# Altium project PicoPrint.PrjPCB (part 1 of 2)
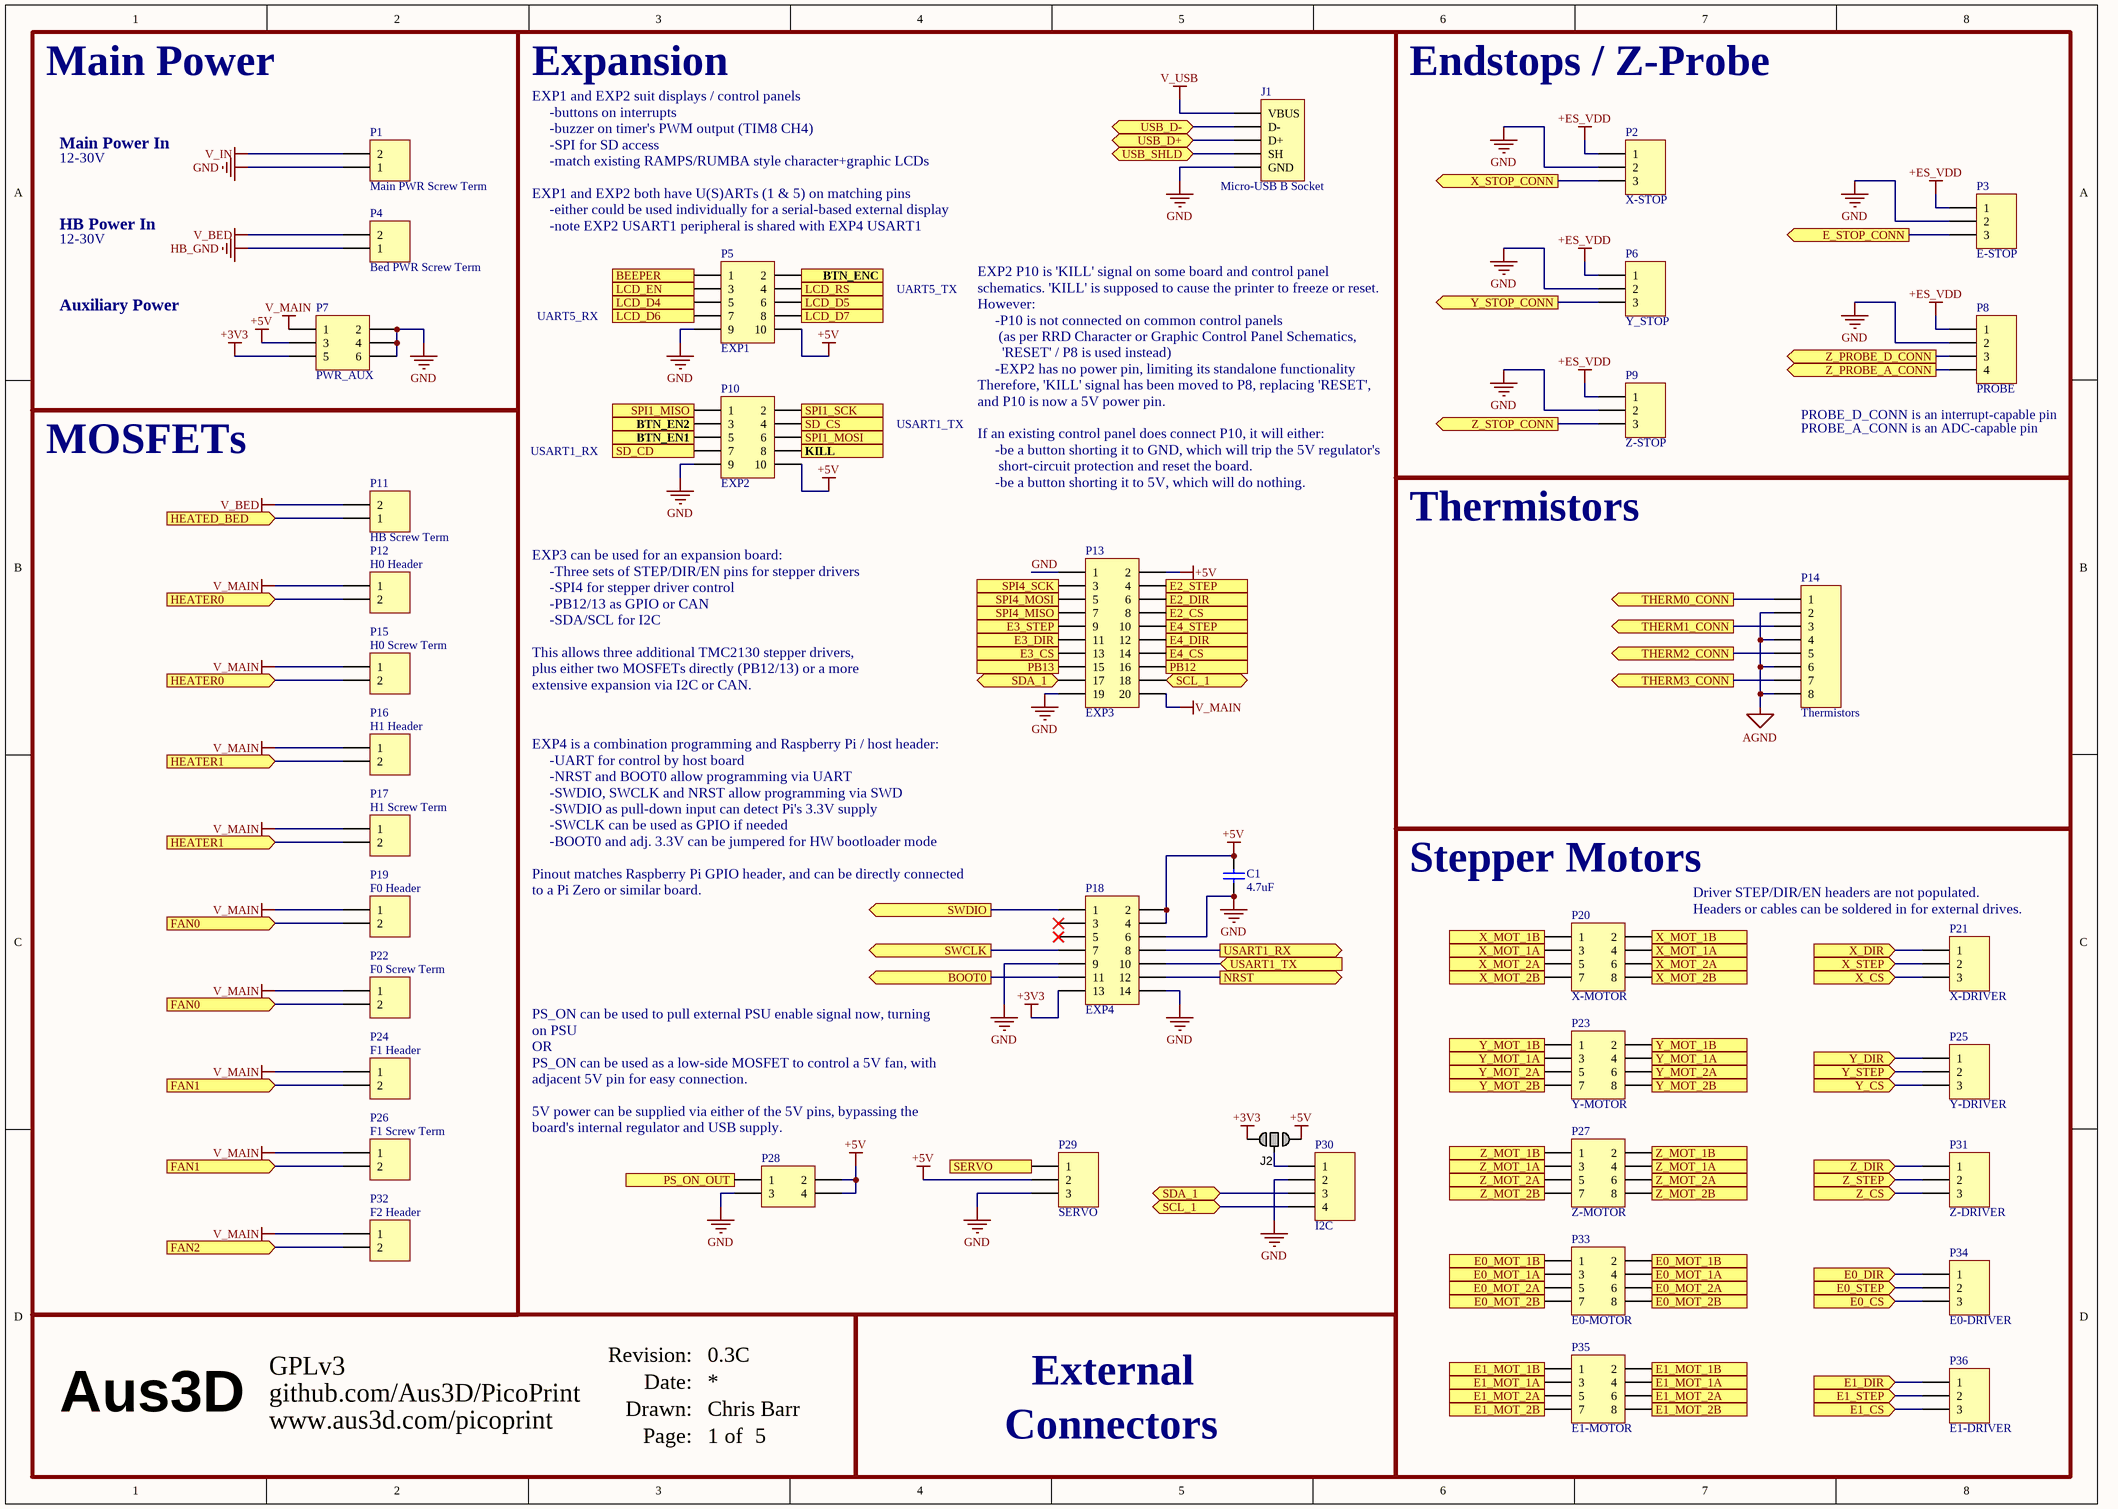
[diagram p0: PicoPrint-Connectors.SchDoc]
Project URL 2: www.aus3d.com/picoprint; Project URL 1: github.com/Aus3D/PicoPrint; Project Revision: 0.3C; Project License: GPLv3; Drawn By: Chris Barr
5 sheets, 296 parts. Net scope: flat (ports and power ports of the same name join across sheets).
Board file: PicoPrint.PcbDoc
Sheets:
  PicoPrint-Connectors.SchDoc
  PicoPrint-Power.SchDoc
  PicoPrint-MOSFETs.SchDoc
  PicoPrint-Motors.SchDoc
  PicoPrint-Main.SchDoc

## Sheet PicoPrint-Connectors.SchDoc
size A3; DocumentNumber: 1; SheetNumber: 1; SheetTotal: 5

### Parts
C1  value 4.7uF  [CAP 1005-0402]  (hidden comment: CapC-0402-4.7uF-10V)
J1  Micro-USB B Socket  [Micro-USB B Molex 105017-0001]
J2  Jumper  [JUMPER-3-NO]  (value not drawn)  (no BOM)
P1  Main PWR Screw Term  [TERM2 5MM]
P2  X-STOP  [HDR1X3-HEADER]
P3  E-STOP  [HDR1X3-HEADER]
P4  Bed PWR Screw Term  [TERM2 5MM]
P5  EXP1  [HDR2X5_exp Iner only\]
P6  Y_STOP  [HDR1X3-HEADER]
P7  PWR_AUX  [HDR2X3-Header]
P8  PROBE  [HDR1X4-HEADER]
P9  Z-STOP  [HDR1X3-HEADER]
P10  EXP2  [HDR2X5_exp Iner only\]
P11  HB Screw Term  [TERM2 5MM]
P12  H0 Header  [HDR1X2-HEADER]
P13  EXP3  [HDR2X10-HEADER]
P14  Thermistors  [HDR1X8-HEADER]
P15  H0 Screw Term  [TERM2 3.5mm]
P16  H1 Header  [HDR1X2-HEADER]
P17  H1 Screw Term  [TERM2 3.5mm]
P18  EXP4  [HDR2X7]
P19  F0 Header  [HDR1X2-HEADER]
P20  X-MOTOR  [HDR2X4-HEADER]
P21  X-DRIVER  [MHDR1X3]  (no BOM)
P22  F0 Screw Term  [TERM2 3.5mm]
P23  Y-MOTOR  [HDR2X4-HEADER]
P24  F1 Header  [HDR1X2-HEADER]
P25  Y-DRIVER  [MHDR1X3]  (no BOM)
P26  F1 Screw Term  [TERM2 3.5mm]
P27  Z-MOTOR  [HDR2X4-HEADER]
P28  Header 2X2  [HDR2X2-Header]  (value not drawn)
P29  SERVO  [HDR1X3-HEADER]
P30  I2C  [HDR1X4-HEADER]
P31  Z-DRIVER  [MHDR1X3]  (no BOM)
P32  F2 Header  [HDR1X2-HEADER]
P33  E0-MOTOR  [HDR2X4-HEADER]
P34  E0-DRIVER  [MHDR1X3]  (no BOM)
P35  E1-MOTOR  [HDR2X4-HEADER]
P36  E1-DRIVER  [MHDR1X3]  (no BOM)

### Blocks framed on the sheet
Main Power: P1 P4 P7
Endstops / Z-Probe: P2 P3 P6 P8 P9
MOSFETs: P11 P12 P15-P17 P19 P22 P24 P26 P32
Thermistors: P14
Stepper Motors: P20 P21 P23 P25 P27 P31 P33-P36

### Ports
BEEPER (in), BOOT0 (out), BTN_EN1 (out), BTN_EN2 (out), BTN_ENC (out), E0_CS (in), E0_DIR (in), E0_MOT_1A (in), E0_MOT_1B (in), E0_MOT_2A (in), E0_MOT_2B (in), E0_STEP (in), E1_CS (in), E1_DIR (in), E1_MOT_1A (in), E1_MOT_1B (in), E1_MOT_2A (in), E1_MOT_2B (in), E1_STEP (in), E2_CS (in), E2_DIR (in), E2_STEP (in), E3_CS (in), E3_DIR (in), E3_STEP (in), E4_CS (in), E4_DIR (in), E4_STEP (in), E_STOP_CONN (out), FAN0 (in), FAN1 (in), FAN2 (in), HEATED_BED (in), HEATER0 (in), HEATER1 (in), KILL (out), LCD_D4 (in), LCD_D5 (in), LCD_D6 (in), LCD_D7 (in), LCD_EN (in), LCD_RS (in), NRST (out), PB12 (in), PB13 (in), PS_ON_OUT (out), SCL_1 (bidir), SD_CD (out), SD_CS (in), SDA_1 (bidir), SERVO (in), SPI1_MISO (in), SPI1_MOSI (out), SPI1_SCK (out), SPI4_MISO (in), SPI4_MOSI (out), SPI4_SCK (out), SWCLK (out), SWDIO (out), THERM0_CONN (out), THERM1_CONN (out), THERM2_CONN (out), THERM3_CONN (out), USART1_RX (out), USART1_TX (in), USB_D+ (bidir), USB_D- (bidir), USB_SHLD (bidir), X_CS (in), X_DIR (in), X_MOT_1A (in), X_MOT_1B (in), X_MOT_2A (in), X_MOT_2B (in), X_STEP (in), X_STOP_CONN (out), Y_CS (in), Y_DIR (in), Y_MOT_1A (in), Y_MOT_1B (in), Y_MOT_2A (in), Y_MOT_2B (in), Y_STEP (in), Y_STOP_CONN (out), Z_CS (in), Z_DIR (in), Z_MOT_1A (in), Z_MOT_1B (in), Z_MOT_2A (in), Z_MOT_2B (in), Z_PROBE_A_CONN (out), Z_PROBE_D_CONN (out), Z_STEP (in), Z_STOP_CONN (out)

### Nets
+3V3: J2.1 P7.5 P18.13
+5V: C1.2 J2.3 P5.10 P7.3 P10.10 P13.2 P18.2 P18.4 P28.2 P28.4 P29.2
+ES_VDD: P2.1 P3.1 P6.1 P8.1 P9.1
AGND: P14.2 P14.4 P14.6 P14.8
GND: C1.1 J1.GND P1.1 P2.2 P3.2 P5.9 P6.2 P7.2 P7.4 P7.6 P8.2 P9.2 P10.9 P13.1 P13.19 P18.6 P18.9 P18.14 P28.3 P29.3 P30.2
HB_GND: P4.1
V_BED: P4.2 P11.2
V_IN: P1.2
V_MAIN: P7.1 P12.1 P13.20 P15.1 P16.1 P17.1 P19.1 P22.1 P24.1 P26.1 P32.1
V_USB: J1.VBUS
BEEPER: P5.1 ; port BEEPER
BOOT0: P18.11 ; port BOOT0
BTN_EN1: P10.5 ; port BTN_EN1
BTN_EN2: P10.3 ; port BTN_EN2
BTN_ENC: P5.2 ; port BTN_ENC
E0_CS: P34.3 ; port E0_CS
E0_DIR: P34.1 ; port E0_DIR
E0_MOT_1A: P33.3 P33.4 ; port E0_MOT_1A
E0_MOT_1B: P33.1 P33.2 ; port E0_MOT_1B
E0_MOT_2A: P33.5 P33.6 ; port E0_MOT_2A
E0_MOT_2B: P33.7 P33.8 ; port E0_MOT_2B
E0_STEP: P34.2 ; port E0_STEP
E1_CS: P36.3 ; port E1_CS
E1_DIR: P36.1 ; port E1_DIR
E1_MOT_1A: P35.3 P35.4 ; port E1_MOT_1A
E1_MOT_1B: P35.1 P35.2 ; port E1_MOT_1B
E1_MOT_2A: P35.5 P35.6 ; port E1_MOT_2A
E1_MOT_2B: P35.7 P35.8 ; port E1_MOT_2B
E1_STEP: P36.2 ; port E1_STEP
E2_CS: P13.8 ; port E2_CS
E2_DIR: P13.6 ; port E2_DIR
E2_STEP: P13.4 ; port E2_STEP
E3_CS: P13.13 ; port E3_CS
E3_DIR: P13.11 ; port E3_DIR
E3_STEP: P13.9 ; port E3_STEP
E4_CS: P13.14 ; port E4_CS
E4_DIR: P13.12 ; port E4_DIR
E4_STEP: P13.10 ; port E4_STEP
E_STOP_CONN: P3.3 ; port E_STOP_CONN
FAN0: P19.2 P22.2 ; port FAN0
FAN1: P24.2 P26.2 ; port FAN1
FAN2: P32.2 ; port FAN2
HEATED_BED: P11.1 ; port HEATED_BED
HEATER0: P12.2 P15.2 ; port HEATER0
HEATER1: P16.2 P17.2 ; port HEATER1
KILL: P10.8 ; port KILL
LCD_D4: P5.5 ; port LCD_D4
LCD_D5: P5.6 ; port LCD_D5
LCD_D6: P5.7 ; port LCD_D6
LCD_D7: P5.8 ; port LCD_D7
LCD_EN: P5.3 ; port LCD_EN
LCD_RS: P5.4 ; port LCD_RS
NRST: P18.12 ; port NRST
PB12: P13.16 ; port PB12
PB13: P13.15 ; port PB13
PS_ON_OUT: P28.1 ; port PS_ON_OUT
SCL_1: P13.18 P30.4 ; port SCL_1
SD_CD: P10.7 ; port SD_CD
SD_CS: P10.4 ; port SD_CS
SDA_1: P13.17 P30.3 ; port SDA_1
SERVO: P29.1 ; port SERVO
SPI1_MISO: P10.1 ; port SPI1_MISO
SPI1_MOSI: P10.6 ; port SPI1_MOSI
SPI1_SCK: P10.2 ; port SPI1_SCK
SPI4_MISO: P13.7 ; port SPI4_MISO
SPI4_MOSI: P13.5 ; port SPI4_MOSI
SPI4_SCK: P13.3 ; port SPI4_SCK
SWCLK: P18.7 ; port SWCLK
SWDIO: P18.1 ; port SWDIO
THERM0_CONN: P14.1 ; port THERM0_CONN
THERM1_CONN: P14.3 ; port THERM1_CONN
THERM2_CONN: P14.5 ; port THERM2_CONN
THERM3_CONN: P14.7 ; port THERM3_CONN
USART1_RX: P18.8 ; port USART1_RX
USART1_TX: P18.10 ; port USART1_TX
USB_N: J1.D- ; port USB_D-
USB_P: J1.D+ ; port USB_D+
USB_SHLD: J1.SHIELD(SH) ; port USB_SHLD
X_CS: P21.3 ; port X_CS
X_DIR: P21.1 ; port X_DIR
X_MOT_1A: P20.3 P20.4 ; port X_MOT_1A
X_MOT_1B: P20.1 P20.2 ; port X_MOT_1B
X_MOT_2A: P20.5 P20.6 ; port X_MOT_2A
X_MOT_2B: P20.7 P20.8 ; port X_MOT_2B
X_STEP: P21.2 ; port X_STEP
X_STOP_CONN: P2.3 ; port X_STOP_CONN
Y_CS: P25.3 ; port Y_CS
Y_DIR: P25.1 ; port Y_DIR
Y_MOT_1A: P23.3 P23.4 ; port Y_MOT_1A
Y_MOT_1B: P23.1 P23.2 ; port Y_MOT_1B
Y_MOT_2A: P23.5 P23.6 ; port Y_MOT_2A
Y_MOT_2B: P23.7 P23.8 ; port Y_MOT_2B
Y_STEP: P25.2 ; port Y_STEP
Y_STOP_CONN: P6.3 ; port Y_STOP_CONN
Z_CS: P31.3 ; port Z_CS
Z_DIR: P31.1 ; port Z_DIR
Z_MOT_1A: P27.3 P27.4 ; port Z_MOT_1A
Z_MOT_1B: P27.1 P27.2 ; port Z_MOT_1B
Z_MOT_2A: P27.5 P27.6 ; port Z_MOT_2A
Z_MOT_2B: P27.7 P27.8 ; port Z_MOT_2B
Z_PROBE_A_CONN: P8.4 ; port Z_PROBE_A_CONN
Z_PROBE_D_CONN: P8.3 ; port Z_PROBE_D_CONN
Z_STEP: P31.2 ; port Z_STEP
Z_STOP_CONN: P9.3 ; port Z_STOP_CONN
NetJ2_2: J2.2 P30.1

Not connected (* = marked no-connect by the designer): P18 3* 5*

### Notes on the sheet
- Expansion
- Main Power In
- 12-30V
- HB Power In
- (near P5) EXP1 and EXP2 suit displays / control panels
  -buttons on interrupts
  -buzzer on timer's PWM output (TIM8 CH4)
  -SPI for SD access
  -match existing RAMPS/RUMBA style character+graphic LCDs
  EXP1 and EXP2 both have U(S)ARTs (1 & 5) on matching pins
  -either could be used individually for a serial-based external display
  -note EXP2 USART1 peripheral is shared with EXP4 USART1
- Auxiliary Power
- UART5_RX
- UART5_TX
- USART1_RX
- USART1_TX
- (near P8) PROBE_D_CONN is an interrupt-capable pin
- (near P8) PROBE_A_CONN is an ADC-capable pin
- EXP2 P10 is 'KILL' signal on some board and control panel schematics. 'KILL' is supposed to cause the printer to freeze or reset. However:
  -P10 is not connected on common control panels
  (as per RRD Character or Graphic Control Panel Schematics,
  'RESET' / P8 is used instead)
  -EXP2 has no power pin, limiting its standalone functionality
  Therefore, 'KILL' signal has been moved to P8, replacing 'RESET', and P10 is now a 5V power pin.
  If an existing control panel does connect P10, it will either:
  -be a button shorting it to GND, which will trip the 5V regulator's
  short-circuit protection and reset the board.
  -be a button shorting it to 5V, which will do nothing.
- EXP3 can be used for an expansion board:
  -Three sets of STEP/DIR/EN pins for stepper drivers
  -SPI4 for stepper driver control
  -PB12/13 as GPIO or CAN
  -SDA/SCL for I2C
  This allows three additional TMC2130 stepper drivers,
  plus either two MOSFETs directly (PB12/13) or a more extensive expansion via I2C or CAN.
- EXP4 is a combination programming and Raspberry Pi / host header:
  -UART for control by host board
  -NRST and BOOT0 allow programming via UART
  -SWDIO, SWCLK and NRST allow programming via SWD
  -SWDIO as pull-down input can detect Pi's 3.3V supply
  -SWCLK can be used as GPIO if needed
  -BOOT0 and adj. 3.3V can be jumpered for HW bootloader mode
  Pinout matches Raspberry Pi GPIO header, and can be directly connected to a Pi Zero or similar board.
- (near P21) Driver STEP/DIR/EN headers are not populated.
  Headers or cables can be soldered in for external drives.
- (near P28) PS_ON can be used to pull external PSU enable signal now, turning on PSU
  OR
  PS_ON can be used as a low-side MOSFET to control a 5V fan, with adjacent 5V pin for easy connection.
  5V power can be supplied via either of the 5V pins, bypassing the board's internal regulator and USB supply.
- Date:
- Revision:
- External
- Aus3D
- Drawn:
- Page:
- of
- Connectors

### Library data of the parts
C1 = CapC-0402-4.7uF-10V: Capacitor (SMD Ceramic); Voltage: 10V; Note: Approved sub OK; Published: 8-Jun-2000; Revision: July-2002: Re-released for DXP Platform.; Publisher: Altium Limited; Supplier 1: Digi-Key; Supplier Part Number 1: 1276-1482-1-ND
J1 = Micro-USB B Socket: Note: Approved sub OK; Supplier 1: Digi-Key; Supplier Part Number 1: WM1399CT-ND
J2 = JUMP3-NO: SMD jumper
P1 P4 P11 = ScrewTerminal-5mm-2Way: Screw Terminal 5mm 2-Way; Supplier 1: Digi-Key; Supplier Part Number 1: 277-6405-ND
P2 P3 P6 P9 P29 = Header 3: Header, 3-Pin; Manufacturer 1: Generic Header; Note: Approved sub OK; LatestRevisionDate: 17-Jul-2002; LatestRevisionNote: Re-released for DXP Platform.; Publisher: Altium Limited
P5 P10 = Header 5X2: Header, 5-Pin, Dual row; Manufacturer 1: Generic Header; Note: Approved sub OK; LatestRevisionDate: 17-Jul-2002; LatestRevisionNote: Re-released for DXP Platform.; Publisher: Altium Limited
P7 = Header 3X2: Header, 3-Pin, Dual row; Manufacturer 1: Generic Header; Note: Approved sub OK; LatestRevisionDate: 17-Jul-2002; LatestRevisionNote: Re-released for DXP Platform.; Publisher: Altium Limited
P8 P30 = Header 4: Header, 4-Pin; Manufacturer 1: Generic Header; Note: Approved sub OK; LatestRevisionDate: 17-Jul-2002; LatestRevisionNote: Re-released for DXP Platform.; Publisher: Altium Limited
P12 P16 P19 P24 P32 = Header 2: Header, 2-Pin; Manufacturer 1: Generic Header; Note: Approved sub OK; LatestRevisionDate: 17-Jul-2002; LatestRevisionNote: Re-released for DXP Platform.; Publisher: Altium Limited
P13 = Header 10X2: Header, 10-Pin, Dual row; Manufacturer 1: Generic Header; Note: Approved sub OK; LatestRevisionDate: 17-Jul-2002; LatestRevisionNote: Re-released for DXP Platform.; Publisher: Altium Limited
P14 = Header 8x1: Header, 8-Pin; Manufacturer 1: Generic Header; Note: Approved sub OK; LatestRevisionDate: 17-Jul-2002; LatestRevisionNote: Re-released for DXP Platform.; Publisher: Altium Limited
P15 P17 P22 P26 = ScrewTerminal-3.5mm-2Way: Screw Terminal 3.5mm 2-Way; Supplier 1: Digi-Key; Supplier Part Number 1: 277-1721-ND
P18 = Header 7X2: Header, 7-Pin, Dual row; Manufacturer 1: Generic Header; Note: Approved sub OK; LatestRevisionDate: 17-Jul-2002; LatestRevisionNote: Re-released for DXP Platform.; Publisher: Altium Limited
P20 P23 P27 P33 P35 = Header 4X2: Header, 4-Pin, Dual row; Manufacturer 1: Generic Header; Note: Approved sub OK; LatestRevisionDate: 17-Jul-2002; LatestRevisionNote: Re-released for DXP Platform.; Publisher: Altium Limited
P21 P25 P31 P34 P36 = MHDR1X3: Header, 3-Pin; LatestRevisionDate: 17-Jul-2002; LatestRevisionNote: Re-released for DXP Platform.; Publisher: Altium Limited
P28 = Header 2X2: Header, 3-Pin, Dual row; Manufacturer 1: Generic Header; Note: Approved sub OK; LatestRevisionDate: 17-Jul-2002; LatestRevisionNote: Re-released for DXP Platform.; Publisher: Altium Limited

## Sheet PicoPrint-Power.SchDoc
size A3; DocumentNumber: 2; SheetNumber: 2; SheetTotal: 5
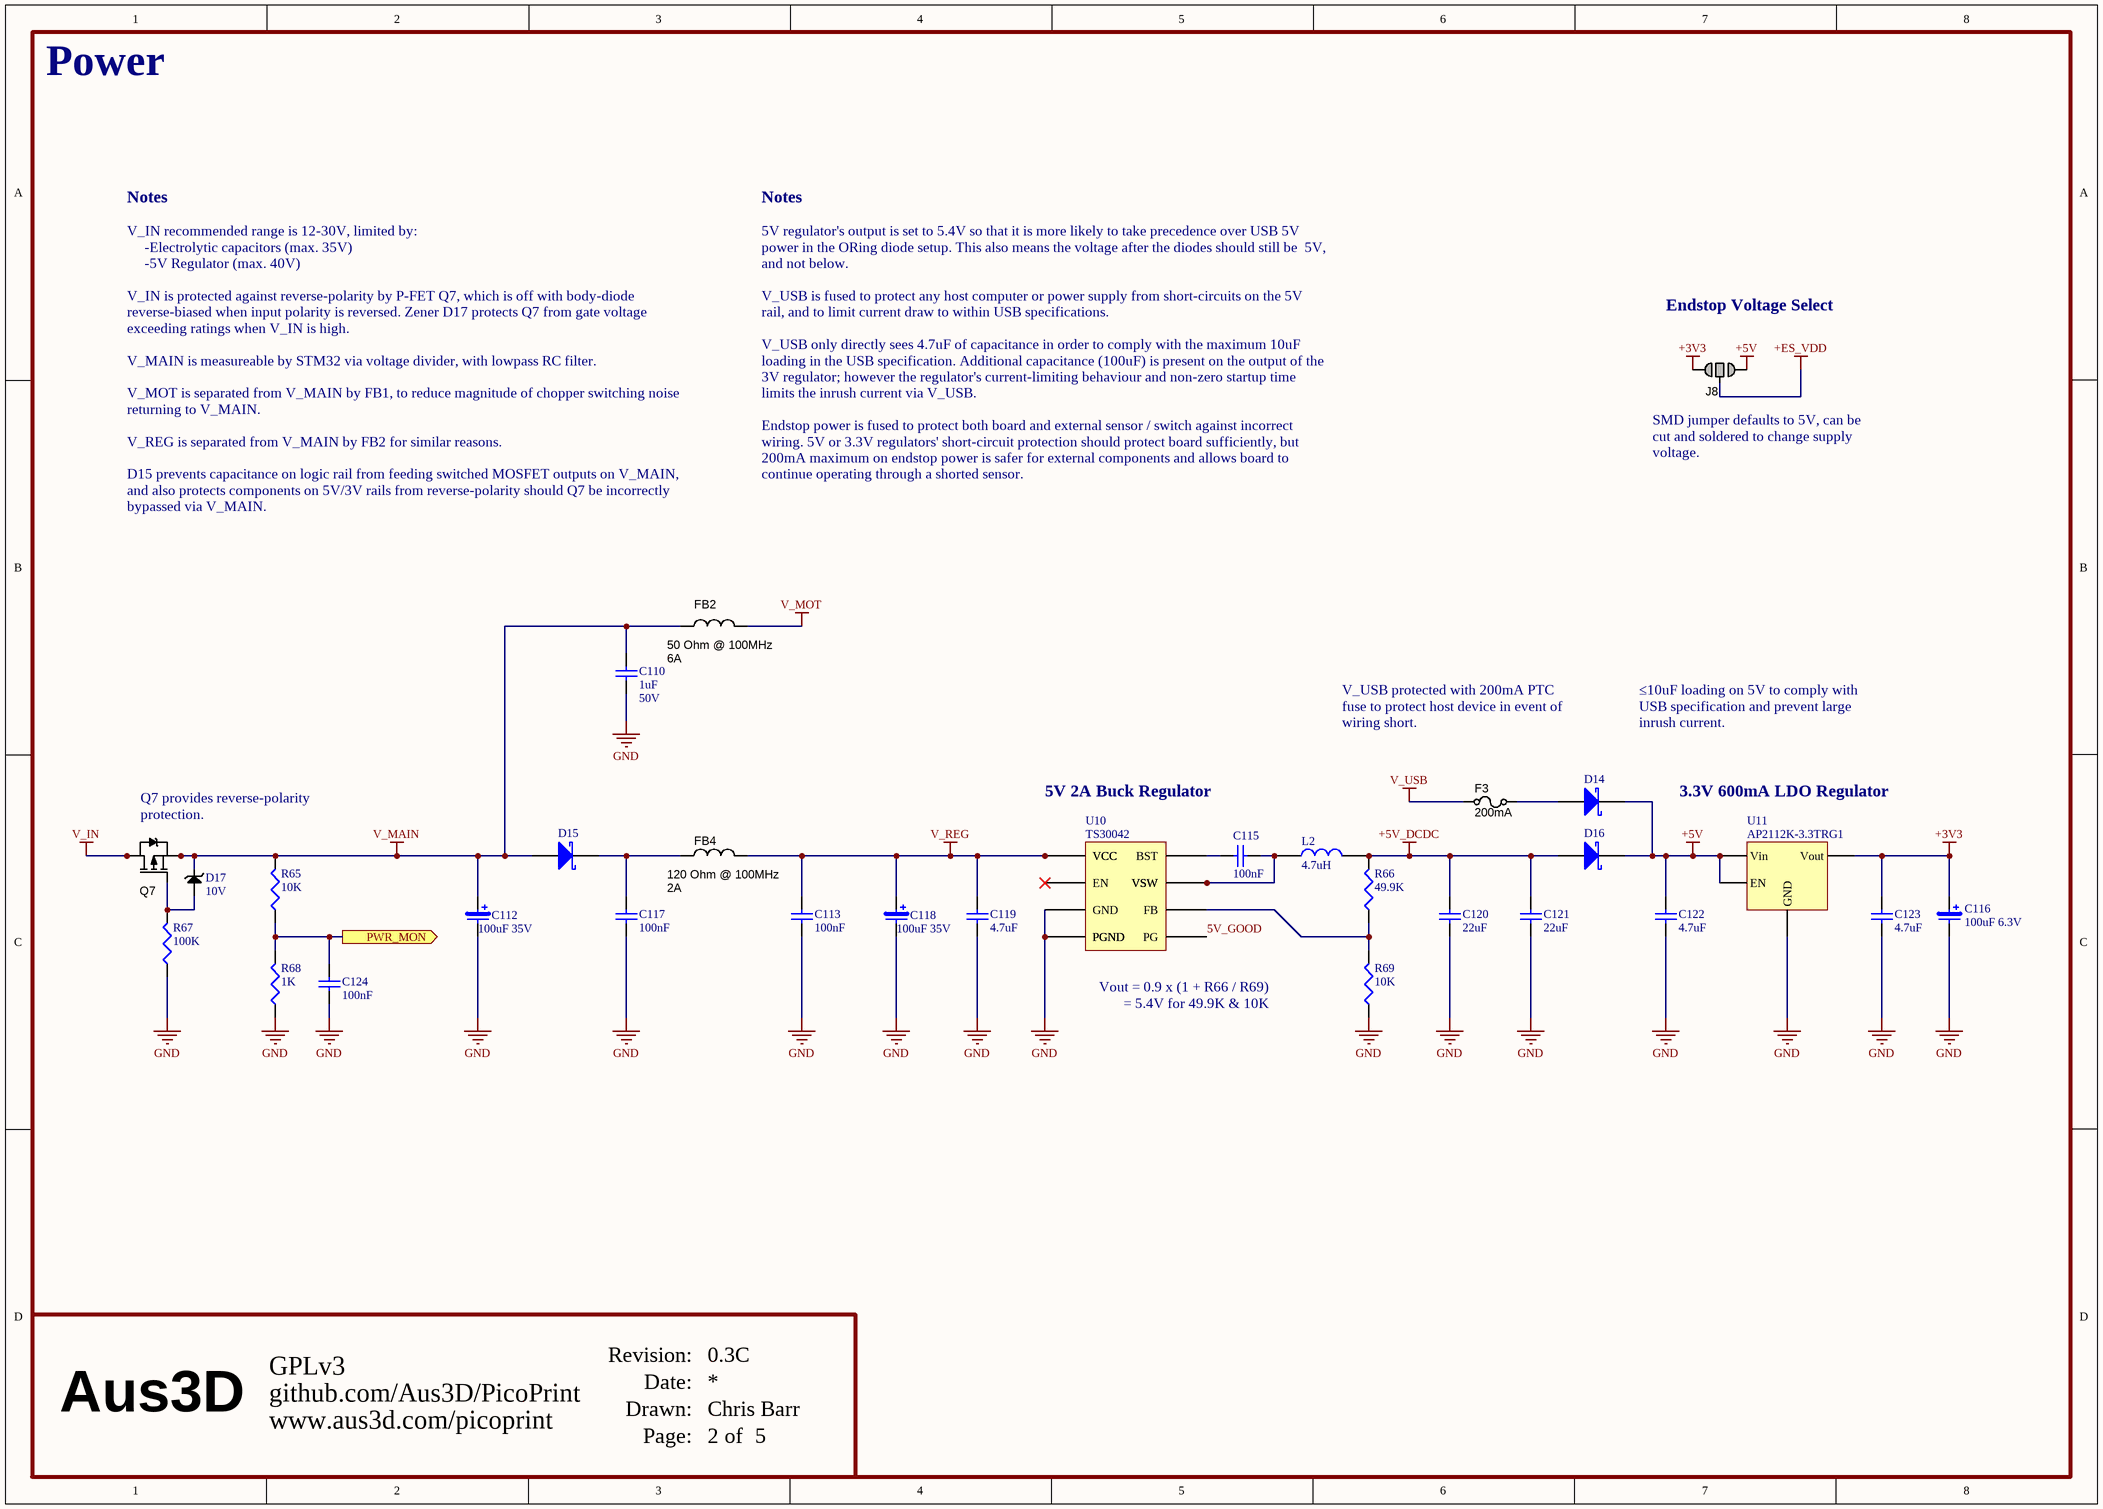
[diagram p1: PicoPrint-Power.SchDoc]

### Parts
C110  value 1uF  Voltage: 50V  [Cap 1608-0603]  (hidden comment: CapC-0603-1uF 50V)
C112  value 100uF 35V  [CAP EL PANASONIC]  (hidden comment: CapE-6.3-100uF-35V)
C113  value 100nF  [CAP 1005-0402]  (hidden comment: CapC-0402-100nF-50V)
C115  value 100nF  [CAP 1005-0402]  (hidden comment: CapC-0402-100nF)
C116  value 100uF 6.3V  [CAP EL 5mm]  (hidden comment: CapE-5.0-100uF-6.3V)
C117  value 100nF  [CAP 1005-0402]  (hidden comment: CapC-0402-100nF-50V)
C118  value 100uF 35V  [CAP EL PANASONIC]  (hidden comment: CapE-6.3-100uF-35V)
C119  value 4.7uF  [CAP 3225-1210]  (hidden comment: CapC-1210-4.7uF-50V)
C120  value 22uF  [CAPC2012X135N]  (hidden comment: CapC-0805-22uF 6.3V)
C121  value 22uF  [CAPC2012X135N]  (hidden comment: CapC-0805-22uF 6.3V)
C122  value 4.7uF  [CAP 1005-0402]  (hidden comment: CapC-0402-4.7uF-10V)
C123  value 4.7uF  [CAP 1005-0402]  (hidden comment: CapC-0402-4.7uF-10V)
C124  value 100nF  [CAP 1005-0402]  (hidden comment: CapC-0402-100nF)
D14  Schottky 2A 40V SOD-123F  [DIOM2616X08N]  (value not drawn)
D15  Schottky 2A 40V SOD-123F  [DIOM2616X08N]  (value not drawn)
D16  Schottky 2A 40V SOD-123F  [DIOM2616X08N]  (value not drawn)
D17  Voltage: 10V  [SOD523]  (hidden comment: Zener 10V 150mW SOD523)
F3  value 200mA  [RES 3216-1206]  (hidden comment: PTC Resettable Fuse)
FB2  Impedance @ Frequency: 50 Ohm @ 100MHz  Current Rating: 6A  [INDC3216X13N]  (hidden comment: 50R @ 100 MHz)
FB4  Impedance @ Frequency: 120 Ohm @ 100MHz  Current Rating: 2A  [INDC1608N]  (hidden comment: 120R @ 100 MHz)
J8  Jumper  [JUMPER-3-NO]  (value not drawn)  (no BOM)
L2  value 4.7uH  [INDUCTOR_NRS5030T4R7MMGJ]  (hidden comment: Inductor SMD 4.7uH 2.6A)
Q7  SI7111EDN-T1-GE3  [PowerPAK 1218-8 Single]  (value not drawn)
R65  value 10K  [RESC1005X40N]  (hidden comment: Res-0402-10K)
R66  value 49.9K  [RESC1005X40N]  (hidden comment: Res-0402-49.9K)
R67  value 100K  [RESC1005X40N]  (hidden comment: Res-0402-100K)
R68  value 1K  [RESC1005X40N]  (hidden comment: Res-0402-1K)
R69  value 10K  [RESC1005X40N]  (hidden comment: Res-0402-10K)
U10  TS30042  [QFN50P300X300X100_HS-17N]
U11  AP2112K-3.3TRG1  [SOT23-5]

### Ports
PWR_MON (out)

### Nets
+3V3: C116.1 C123.2 J8.1 U11.5(Vout)
+5V: C122.2 D14.K D16.K J8.3 U11.1(Vin) U11.3(EN)
+5V_DCDC: C120.2 C121.2 D16.A L2.2 R66.2
+ES_VDD: J8.2
GND: C110.1 C112.2 C113.1 C116.2 C117.1 C118.2 C119.1 C120.1 C121.1 C122.1 C123.1 C124.1 R67.1 R68.1 R69.1 U10.4(GND) U10.14(PGND) U10.15(PGND) U10.17(PGND) U11.2(GND)
V_IN: Q7.5(D) Q7.6(D) Q7.7(D) Q7.8(D) Q7.9(D)
V_MAIN: C110.2 C112.1 D15.A D17.K FB2.1 Q7.1(S) Q7.2(S) Q7.3(S) R65.2
V_MOT: FB2.2
V_REG: C113.2 C118.1 C119.2 FB4.2 U10.2(VCC) U10.3(VCC) U10.11(VCC)
V_USB: F3.1
5V_GOOD: U10.8(PG)
PWR_MON: C124.2 R65.1 R68.2 ; port PWR_MON
NetC115_1: C115.1 U10.10(BST)
NetC115_2: C115.2 L2.1 U10.1(VSW) U10.12(VSW) U10.13(VSW) U10.16(VSW)
NetC117_2: C117.2 D15.K FB4.1
NetD14_A: D14.A F3.2
NetD17_A: D17.A Q7.4(G) R67.2
NetR66_1: R66.1 R69.2 U10.5(FB)

Not connected (* = marked no-connect by the designer): U10 9(EN)*

### Notes on the sheet
- Power
- Notes
- Endstop Voltage Select
- 5V regulator's output is set to 5.4V so that it is more likely to take precedence over USB 5V power in the ORing diode setup. This also means the voltage after the diodes should still be  5V, and not below.
  V_USB is fused to protect any host computer or power supply from short-circuits on the 5V rail, and to limit current draw to within USB specifications.
  V_USB only directly sees 4.7uF of capacitance in order to comply with the maximum 10uF loading in the USB specification. Additional capacitance (100uF) is present on the output of the 3V regulator; however the regulator's current-limiting behaviour and non-zero startup time limits the inrush current via V_USB.
  Endstop power is fused to protect both board and external sensor / switch against incorrect wiring. 5V or 3.3V regulators' short-circuit protection should protect board sufficiently, but 200mA maximum on endstop power is safer for external components and allows board to continue operating through a shorted sensor.
- (near J8) SMD jumper defaults to 5V, can be cut and soldered to change supply voltage.
- V_IN recommended range is 12-30V, limited by:
  -Electrolytic capacitors (max. 35V)
  -5V Regulator (max. 40V)
  V_IN is protected against reverse-polarity by P-FET Q7, which is off with body-diode reverse-biased when input polarity is reversed. Zener D17 protects Q7 from gate voltage exceeding ratings when V_IN is high.
  V_MAIN is measureable by STM32 via voltage divider, with lowpass RC filter.
  V_MOT is separated from V_MAIN by FB1, to reduce magnitude of chopper switching noise returning to V_MAIN.
  V_REG is separated from V_MAIN by FB2 for similar reasons.
  D15 prevents capacitance on logic rail from feeding switched MOSFET outputs on V_MAIN, and also protects components on 5V/3V rails from reverse-polarity should Q7 be incorrectly bypassed via V_MAIN.
- V_USB protected with 200mA PTC fuse to protect host device in event of wiring short.
- ≤10uF loading on 5V to comply with USB specification and prevent large inrush current.
- Q7 provides reverse-polarity protection.
- 5V 2A Buck Regulator
- 3.3V 600mA LDO Regulator
- Vout = 0.9 x (1 + R66 / R69)
  = 5.4V for 49.9K & 10K
- Date:
- Revision:
- Aus3D
- Drawn:
- Page:
- of

### Library data of the parts
C110 = CapC-0603-1uF 50V: Capacitor (SMD Ceramic); Note: Approved sub OK; Published: 8-Jun-2000; Revision: July-2002: Re-released for DXP Platform.; Publisher: Altium Limited; Supplier 1: Digi-Key; Supplier Part Number 1: 1276-1860-1-ND
C112 C118 = CapE-6.3-100uF-35V: Capacitor (SMD Polarised Electrolytic); Note: Approved sub OK; Published: 8-Jun-2000; Revision: July-2002: Re-released for DXP Platform.; Publisher: Altium Limited; Supplier 1: Digi-Key; Supplier Part Number 1: PCE5016CT-ND
C113 C117 = CapC-0402-100nF-50V: Capacitor (SMD Ceramic); Voltage: 50V; Note: Approved sub OK; Published: 8-Jun-2000; Revision: July-2002: Re-released for DXP Platform.; Publisher: Altium Limited; Supplier 1: Digi-Key; Supplier Part Number 1: 490-10700-1-ND
C115 C124 = CapC-0402-100nF: Capacitor (SMD Ceramic); Note: Approved sub OK; Published: 8-Jun-2000; Revision: July-2002: Re-released for DXP Platform.; Publisher: Altium Limited; Supplier 1: Digi-Key; Supplier Part Number 1: 311-1336-1-ND
C116 = CapE-5.0-100uF-6.3V: Capacitor (SMD Polarised Electrolytic); Note: Approved sub OK; Published: 8-Jun-2000; Revision: July-2002: Re-released for DXP Platform.; Publisher: Altium Limited; Supplier 1: Digi-Key; Supplier Part Number 1: 565-2057-1-ND
C119 = CapC-1210-4.7uF-50V: Capacitor (SMD Ceramic); Note: Approved sub OK; Published: 8-Jun-2000; Revision: July-2002: Re-released for DXP Platform.; Publisher: Altium Limited; Supplier 1: Digi-Key; Supplier Part Number 1: 490-1864-1-ND
C120 C121 = CapC-0805-22uF 6.3V: Capacitor (SMD Ceramic); Note: Approved sub OK; Published: 8-Jun-2000; Revision: July-2002: Re-released for DXP Platform.; Publisher: Altium Limited; Supplier 1: Digi-Key; Supplier Part Number 1: 1276-6460-1-ND
C122 C123 = CapC-0402-4.7uF-10V: as C1 on sheet PicoPrint-Connectors; Published: 8-Jun-2000; Revision: July-2002: Re-released for DXP Platform.; Publisher: Altium Limited; Supplier 1: Digi-Key; Supplier Part Number 1: 1276-1482-1-ND
D14-D16 = Diode Schottky 2A 40V (SS24FL): Diode (SMD); Code - JEDEC: DO-214-AB; Note: Approved sub OK; Published: 8-Jun-2000; Revision: July-2002: Re-released for DXP Platform.; Publisher: Altium Limited; Supplier 1: Digi-Key; Supplier Part Number 1: SS24FLCT-ND
D17 = Diode Zener 10V: Diode (SMD); Code - JEDEC: DO-214-AB; Note: Approved sub OK; Published: 8-Jun-2000; Revision: July-2002: Re-released for DXP Platform.; Publisher: Altium Limited; Supplier 1: Digi-Key; Supplier Part Number 1: DZ2S100M0LCT-ND
F3 = Fuse - 30V 400mA Trip PTC SMD 1206: Note: Approved sub OK; Package / Case: 1206 (3216 metric); Supplier 1: Digi-Key; Supplier Part Number 1: 507-1797-1-ND
FB2 = FERRITE_50R-100MHz_1206: Ferrite bead 50 Ohm at 100 MHz 6A 1206 SMD; Number of Lines: 1; Note: Approved sub OK; Applications: Power Supplies; Operating Temperature: -40°C ~ 105°C; Mounting Type: Surface Mount; Height (Max): 0.037" (0.95mm); Value: 50R @ 100 MHz; Supplier 1: Digi-Key; Supplier Part Number 1: 240-2412-1-ND
FB4 = FERRITE_120R-100MHz_0603: Ferrite bead 120 Ohm at 100 MHz 2A 0603 SMD; Manufacturer 1: Murata Electronics North America; Manufacturer Part Number 1: BLM18PG121SN1D; Current: 900mA; DC Resistance (DCR): 172.9 mOhm Max; Frequency - Self Resonant: 23MHz; Frequency - Test: 100kHz; Filter Type: Differential Mode - Single; Number of Lines: 1; Ratings: 2 A; 50 mO DC; SCDType: source; Note: Approved sub OK; Current - Saturation: 900mA; Current - Temperature Rise: 900mA; Applications: Power Supplies; Package / Case: 1210 (3225 Metric); Operating Temperature: -40°C ~ 105°C; ComponentLink1URL: http://www.yuden.co.jp/ut/product/pdf/wound02_e.pdf; ComponentLink1Description: http://www.yuden.co.jp/ut/product/pdf/wound02_e.pdf; Supplier 1: Digi-Key; Supplier Part Number 1: 490-1037-1-ND; Mounting Type: Surface Mount; Height (Max): 0.037" (0.95mm); Size / Dimension: 0.063" L x 0.031" W (1.60mm x 0.80mm); ComponentLink2URL: http://search.murata.co.jp/Ceramy/image/img/PDF/ENG/L0110S0100BLM18P.pdf; ComponentLink2Description: http://search.murata.co.jp/Ceramy/image/img/PDF/ENG/L0110S0100BLM18P.pdf; Value: 120R @ 100 MHz
J8 = JUMP3-NO: SMD jumper
L2 = Inductor SMD 4.7uH 2.6A: 4.7µH Shielded Wirewound Inductor 2.6A 35 mOhm Nonstandard; Note: Approved sub OK; Published: 24-Mar-1999; Revision: July-2002: Re-released for DXP Platform.; Publisher: Altium Limited; Supplier 1: Digi-Key; Supplier Part Number 1: 587-3461-1-ND
Q7 = MOSFET - SI7111EDN-T1-GE3: MOSFET SMD P-CH 30V 60A PowerPAK1212; FET Type: MOSFET P-Channel, Metal Oxide; Supplier 1: Digi-Key; Supplier Part Number 1: SI7111EDN-T1-GE3CT-ND
R65 R69 = Res-0402-10K: Resistor; Note: Approved sub OK; Published: 8-Jun-2000; Revision: July-2002: Re-released for DXP Platform.; Publisher: Altium Limited; Supplier 1: Digi-Key; Supplier Part Number 1: 311-10KJRCT-ND
R66 = Res-0402-49.9K: Resistor; Note: Approved sub OK; Published: 8-Jun-2000; Revision: July-2002: Re-released for DXP Platform.; Publisher: Altium Limited; Supplier 1: Digi-Key; Supplier Part Number 1: 311-2296-1-ND
R67 = Res-0402-100K: Resistor; Note: Approved sub OK; Published: 8-Jun-2000; Revision: July-2002: Re-released for DXP Platform.; Publisher: Altium Limited; Supplier 1: Digi-Key; Supplier Part Number 1: 311-100KJRCT-ND
R68 = Res-0402-1K: Resistor; Note: Approved sub OK; Published: 8-Jun-2000; Revision: July-2002: Re-released for DXP Platform.; Publisher: Altium Limited; Supplier 1: Digi-Key; Supplier Part Number 1: 311-1.0KJRCT-ND
U10 = Regulator - TS30042 Buck Regulator: Buck Regulator; Supplier 1: Digi-Key; Supplier Part Number 1: TS30042-M000QFNRCT-ND
U11 = Regulator - AP2112K 3.3V Linear Regulator: 3.3V LDO Regulator; Supplier 1: Digi-Key; Supplier Part Number 1: AP2112K-3.3TRG1DICT-ND

## Sheet PicoPrint-MOSFETs.SchDoc
size A3; DocumentNumber: 3; SheetNumber: 3; SheetTotal: 5
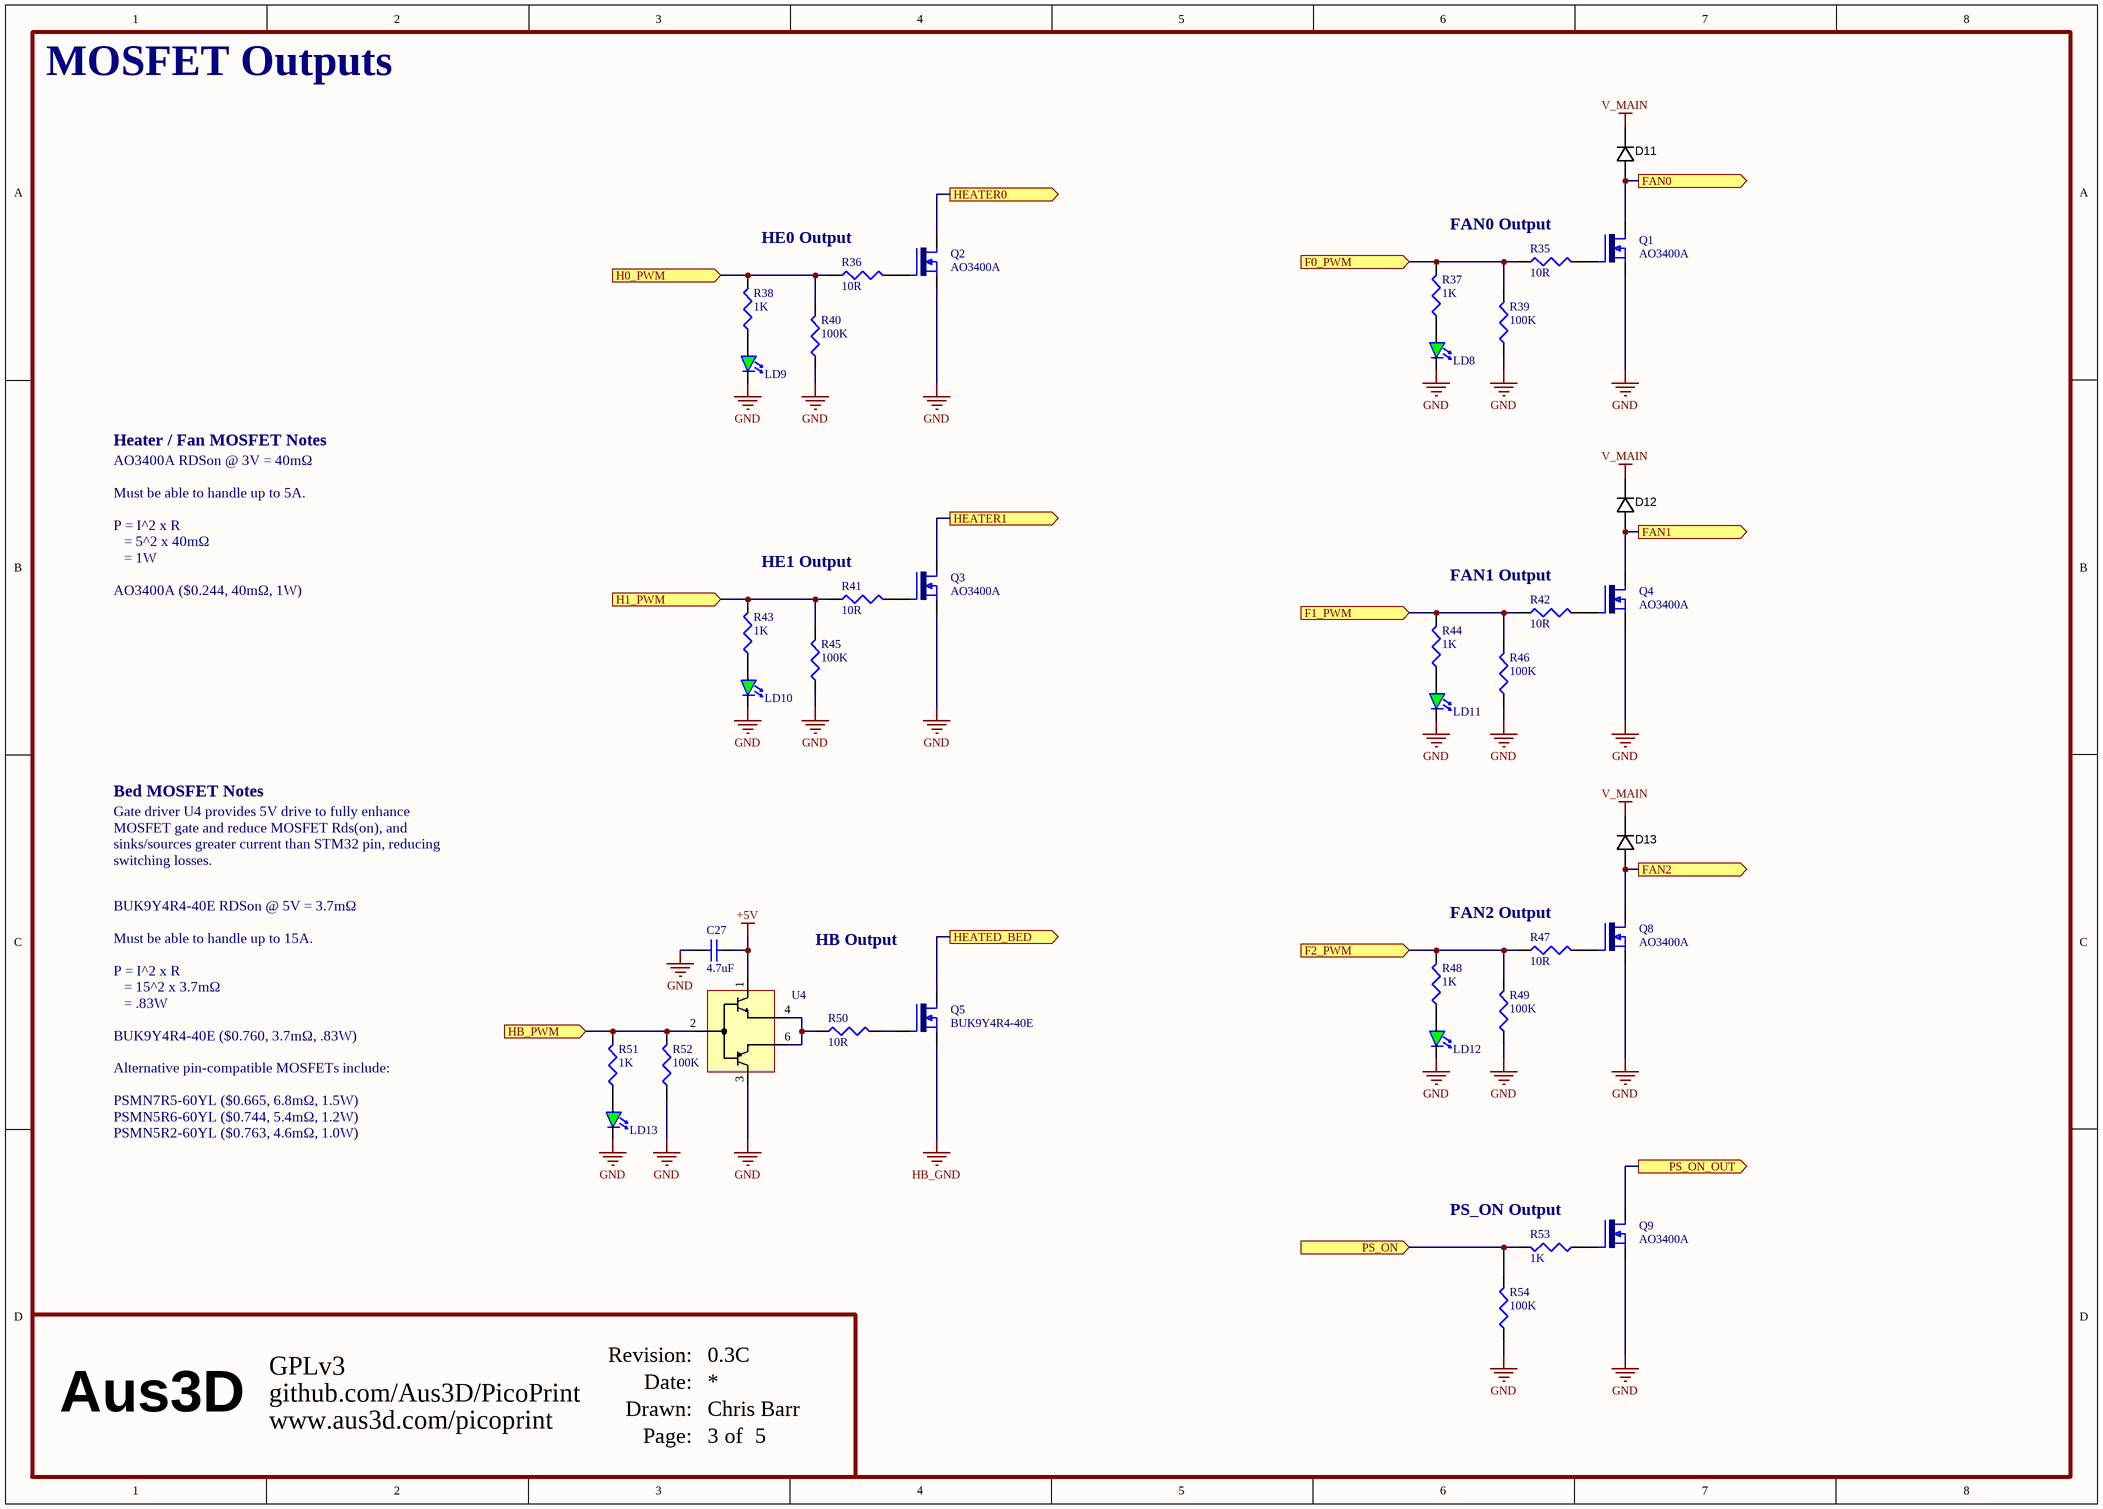
[diagram p2: PicoPrint-MOSFETs.SchDoc]

### Parts
C27  value 4.7uF  [CAP 1005-0402]  (hidden comment: CapC-0402-4.7uF-10V)
D11  General 500mW 75V SOD323  [SOD323]  (value not drawn)
D12  General 500mW 75V SOD323  [SOD323]  (value not drawn)
D13  General 500mW 75V SOD323  [SOD323]  (value not drawn)
LD8  LED-0402  [LED 0402]  (value not drawn)
LD9  LED-0402  [LED 0402]  (value not drawn)
LD10  LED-0402  [LED 0402]  (value not drawn)
LD11  LED-0402  [LED 0402]  (value not drawn)
LD12  LED-0402  [LED 0402]  (value not drawn)
LD13  LED-0402  [LED 0402]  (value not drawn)
Q1  AO3400A  [SOT23-3 New]
Q2  AO3400A  [SOT23-3 New]
Q3  AO3400A  [SOT23-3 New]
Q4  AO3400A  [SOT23-3 New]
Q5  BUK9Y4R4-40E  [LFPACK]
Q8  AO3400A  [SOT23-3 New]
Q9  AO3400A  [SOT23-3 New]
R35  value 10R  [RESC1005X40N]  (hidden comment: Res-0402-10R)
R36  value 10R  [RESC1005X40N]  (hidden comment: Res-0402-10R)
R37  value 1K  [RESC1005X40N]  (hidden comment: Res-0402-1K)
R38  value 1K  [RESC1005X40N]  (hidden comment: Res-0402-1K)
R39  value 100K  [RESC1005X40N]  (hidden comment: Res-0402-100K)
R40  value 100K  [RESC1005X40N]  (hidden comment: Res-0402-100K)
R41  value 10R  [RESC1005X40N]  (hidden comment: Res-0402-10R)
R42  value 10R  [RESC1005X40N]  (hidden comment: Res-0402-10R)
R43  value 1K  [RESC1005X40N]  (hidden comment: Res-0402-1K)
R44  value 1K  [RESC1005X40N]  (hidden comment: Res-0402-1K)
R45  value 100K  [RESC1005X40N]  (hidden comment: Res-0402-100K)
R46  value 100K  [RESC1005X40N]  (hidden comment: Res-0402-100K)
R47  value 10R  [RESC1005X40N]  (hidden comment: Res-0402-10R)
R48  value 1K  [RESC1005X40N]  (hidden comment: Res-0402-1K)
R49  value 100K  [RESC1005X40N]  (hidden comment: Res-0402-100K)
R50  value 10R  [RESC1005X40N]  (hidden comment: Res-0402-10R)
R51  value 1K  [RESC1005X40N]  (hidden comment: Res-0402-1K)
R52  value 100K  [RESC1005X40N]  (hidden comment: Res-0402-100K)
R53  value 1K  [RESC1005X40N]  (hidden comment: Res-0402-1K)
R54  value 100K  [RESC1005X40N]  (hidden comment: Res-0402-100K)
U4  Gate Driver  [SOT363]  (value not drawn)

### Ports
F0_PWM (in), F1_PWM (in), F2_PWM (in), FAN0 (out), FAN1 (out), FAN2 (out), H0_PWM (in), H1_PWM (in), HB_PWM (in), HEATED_BED (out), HEATER0 (out), HEATER1 (out), PS_ON (in), PS_ON_OUT (out)

### Nets
+5V: C27.1 U4.1(VCC)
GND: C27.2 LD8.2(K) LD9.2(K) LD10.2(K) LD11.2(K) LD12.2(K) LD13.2(K) Q1.2(S) Q2.2(S) Q3.2(S) Q4.2(S) Q8.2(S) Q9.2(S) R39.1 R40.1 R45.1 R46.1 R49.1 R52.1 R54.1 U4.3(VEE)
HB_GND: Q5.3(S)
V_MAIN: D11.K D12.K D13.K
F0_PWM: R35.1 R37.2 R39.2 ; port F0_PWM
F1_PWM: R42.1 R44.2 R46.2 ; port F1_PWM
F2_PWM: R47.1 R48.2 R49.2 ; port F2_PWM
FAN0: D11.A Q1.3(D) ; port FAN0
FAN1: D12.A Q4.3(D) ; port FAN1
FAN2: D13.A Q8.3(D) ; port FAN2
H0_PWM: R36.1 R38.2 R40.2 ; port H0_PWM
H1_PWM: R41.1 R43.2 R45.2 ; port H1_PWM
HB_PWM: R51.2 R52.2 U4.2(IN) ; port HB_PWM
HEATED_BED: Q5.2(D) ; port HEATED_BED
HEATER0: Q2.3(D) ; port HEATER0
HEATER1: Q3.3(D) ; port HEATER1
PS_ON: R53.2 R54.2 ; port PS_ON
PS_ON_OUT: Q9.3(D) ; port PS_ON_OUT
NetLD8_1: LD8.1(A) R37.1
NetLD9_1: LD9.1(A) R38.1
NetLD10_1: LD10.1(A) R43.1
NetLD11_1: LD11.1(A) R44.1
NetLD12_1: LD12.1(A) R48.1
NetLD13_1: LD13.1(A) R51.1
NetQ1_1: Q1.1(G) R35.2
NetQ2_1: Q2.1(G) R36.2
NetQ3_1: Q3.1(G) R41.2
NetQ4_1: Q4.1(G) R42.2
NetQ5_1: Q5.1(G) R50.2
NetQ8_1: Q8.1(G) R47.2
NetQ9_1: Q9.1(G) R53.1
NetR50_1: R50.1 U4.4(SOURCE) U4.6(SINK)

### Notes on the sheet
- MOSFET Outputs
- HE0 Output
- FAN0 Output
- Heater / Fan MOSFET Notes
- HE1 Output
- FAN1 Output
- AO3400A RDSon @ 3V = 40mΩ
  Must be able to handle up to 5A.
  P = I^2 x R
  = 5^2 x 40mΩ
  = 1W
  AO3400A ($0.244, 40mΩ, 1W)
- Bed MOSFET Notes
- Gate driver U4 provides 5V drive to fully enhance MOSFET gate and reduce MOSFET Rds(on), and sinks/sources greater current than STM32 pin, reducing switching losses.
- FAN2 Output
- HB Output
- BUK9Y4R4-40E RDSon @ 5V = 3.7mΩ
  Must be able to handle up to 15A.
  P = I^2 x R
  = 15^2 x 3.7mΩ
  = .83W
  BUK9Y4R4-40E ($0.760, 3.7mΩ, .83W)
  Alternative pin-compatible MOSFETs include:
  PSMN7R5-60YL ($0.665, 6.8mΩ, 1.5W)
  PSMN5R6-60YL ($0.744, 5.4mΩ, 1.2W)
  PSMN5R2-60YL ($0.763, 4.6mΩ, 1.0W)
- (near R53) PS_ON Output
- Date:
- Revision:
- Aus3D
- Drawn:
- Page:
- of

### Library data of the parts
C27 = CapC-0402-4.7uF-10V: as C1 on sheet PicoPrint-Connectors; Published: 8-Jun-2000; Revision: July-2002: Re-released for DXP Platform.; Publisher: Altium Limited; Supplier 1: Digi-Key; Supplier Part Number 1: 1276-1482-1-ND
D11-D13 = DIODE_75V_500mW: Diode (SMD); Manufacturer: Micro Commercial Co; Manufacturer Part Number: 1N4148WX-TP; Ratings: 75V; 300mA; 0.5W; Material: Si; Diode Type: Standard; Value: Vf=1V @ 50mA; SCDType: source; Note: Approved sub OK; Package / Case: SOD323; Supplier 1: Digi-Key; Supplier Part Number 1: 1N4148WXTPMSCT-ND
LD8-LD13 = LEDG  0402: LED (SMD); Note: Approved sub OK; Value: Green; Supplier 1: Digi-Key; Supplier Part Number 1: 732-11992-1-ND; Parameter 1: *
Q1-Q4 Q8 Q9 = MOSFET - AO3400A: N-CH MOSFET 30V 5.7A SOT23; Supplier 1: Digi-Key; Supplier Part Number 1: 785-1000-1-ND
Q5 = MOSFET - PSMN1R8-40YLC: N-CH MOSFET 40V 100A LFPAK; Supplier 1: Digi-Key; Supplier Part Number 1: 1727-1502-1-ND
R35 R36 R41 R42 R47 R50 = Res-0402-10R: Resistor; Note: Approved sub OK; Published: 8-Jun-2000; Revision: July-2002: Re-released for DXP Platform.; Publisher: Altium Limited; Supplier 1: Digi-Key; Supplier Part Number 1: 311-10JRCT-ND
R37 R38 R43 R44 R48 R51 R53 = Res-0402-1K: Resistor; Note: Approved sub OK; Published: 8-Jun-2000; Revision: July-2002: Re-released for DXP Platform.; Publisher: Altium Limited; Supplier 1: Digi-Key; Supplier Part Number 1: 311-1.0KJRCT-ND
R39 R40 R45 R46 R49 R52 R54 = Res-0402-100K: Resistor; Note: Approved sub OK; Published: 8-Jun-2000; Revision: July-2002: Re-released for DXP Platform.; Publisher: Altium Limited; Supplier 1: Digi-Key; Supplier Part Number 1: 311-100KJRCT-ND
U4 = MOSFET Driver - 40V 1A Gate Driver ZXGD3009DY: MOSFET Gate Driver IC; Supplier 1: Digi-Key; Supplier Part Number 1: ZXGD3009DYTADICT-ND

## Sheet PicoPrint-Motors.SchDoc
size A2; DocumentNumber: 4; SheetNumber: 4; SheetTotal: 5
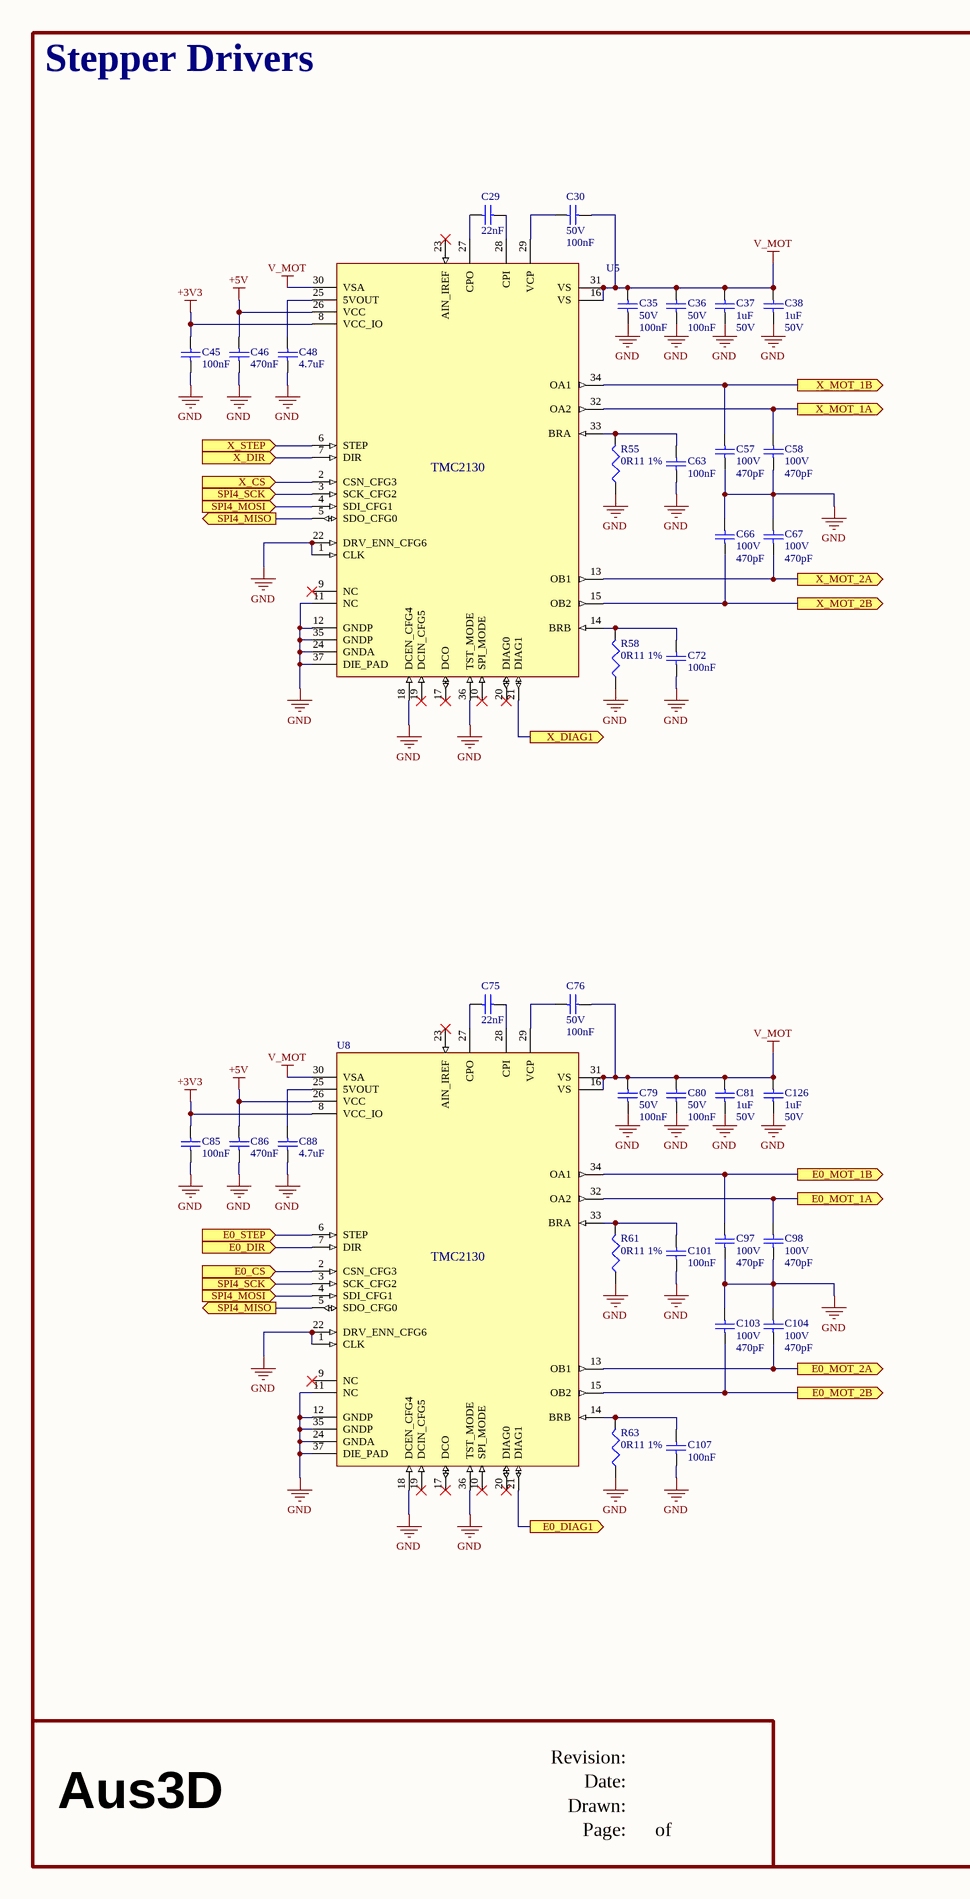
[diagram p3: PicoPrint-Motors.SchDoc, left]
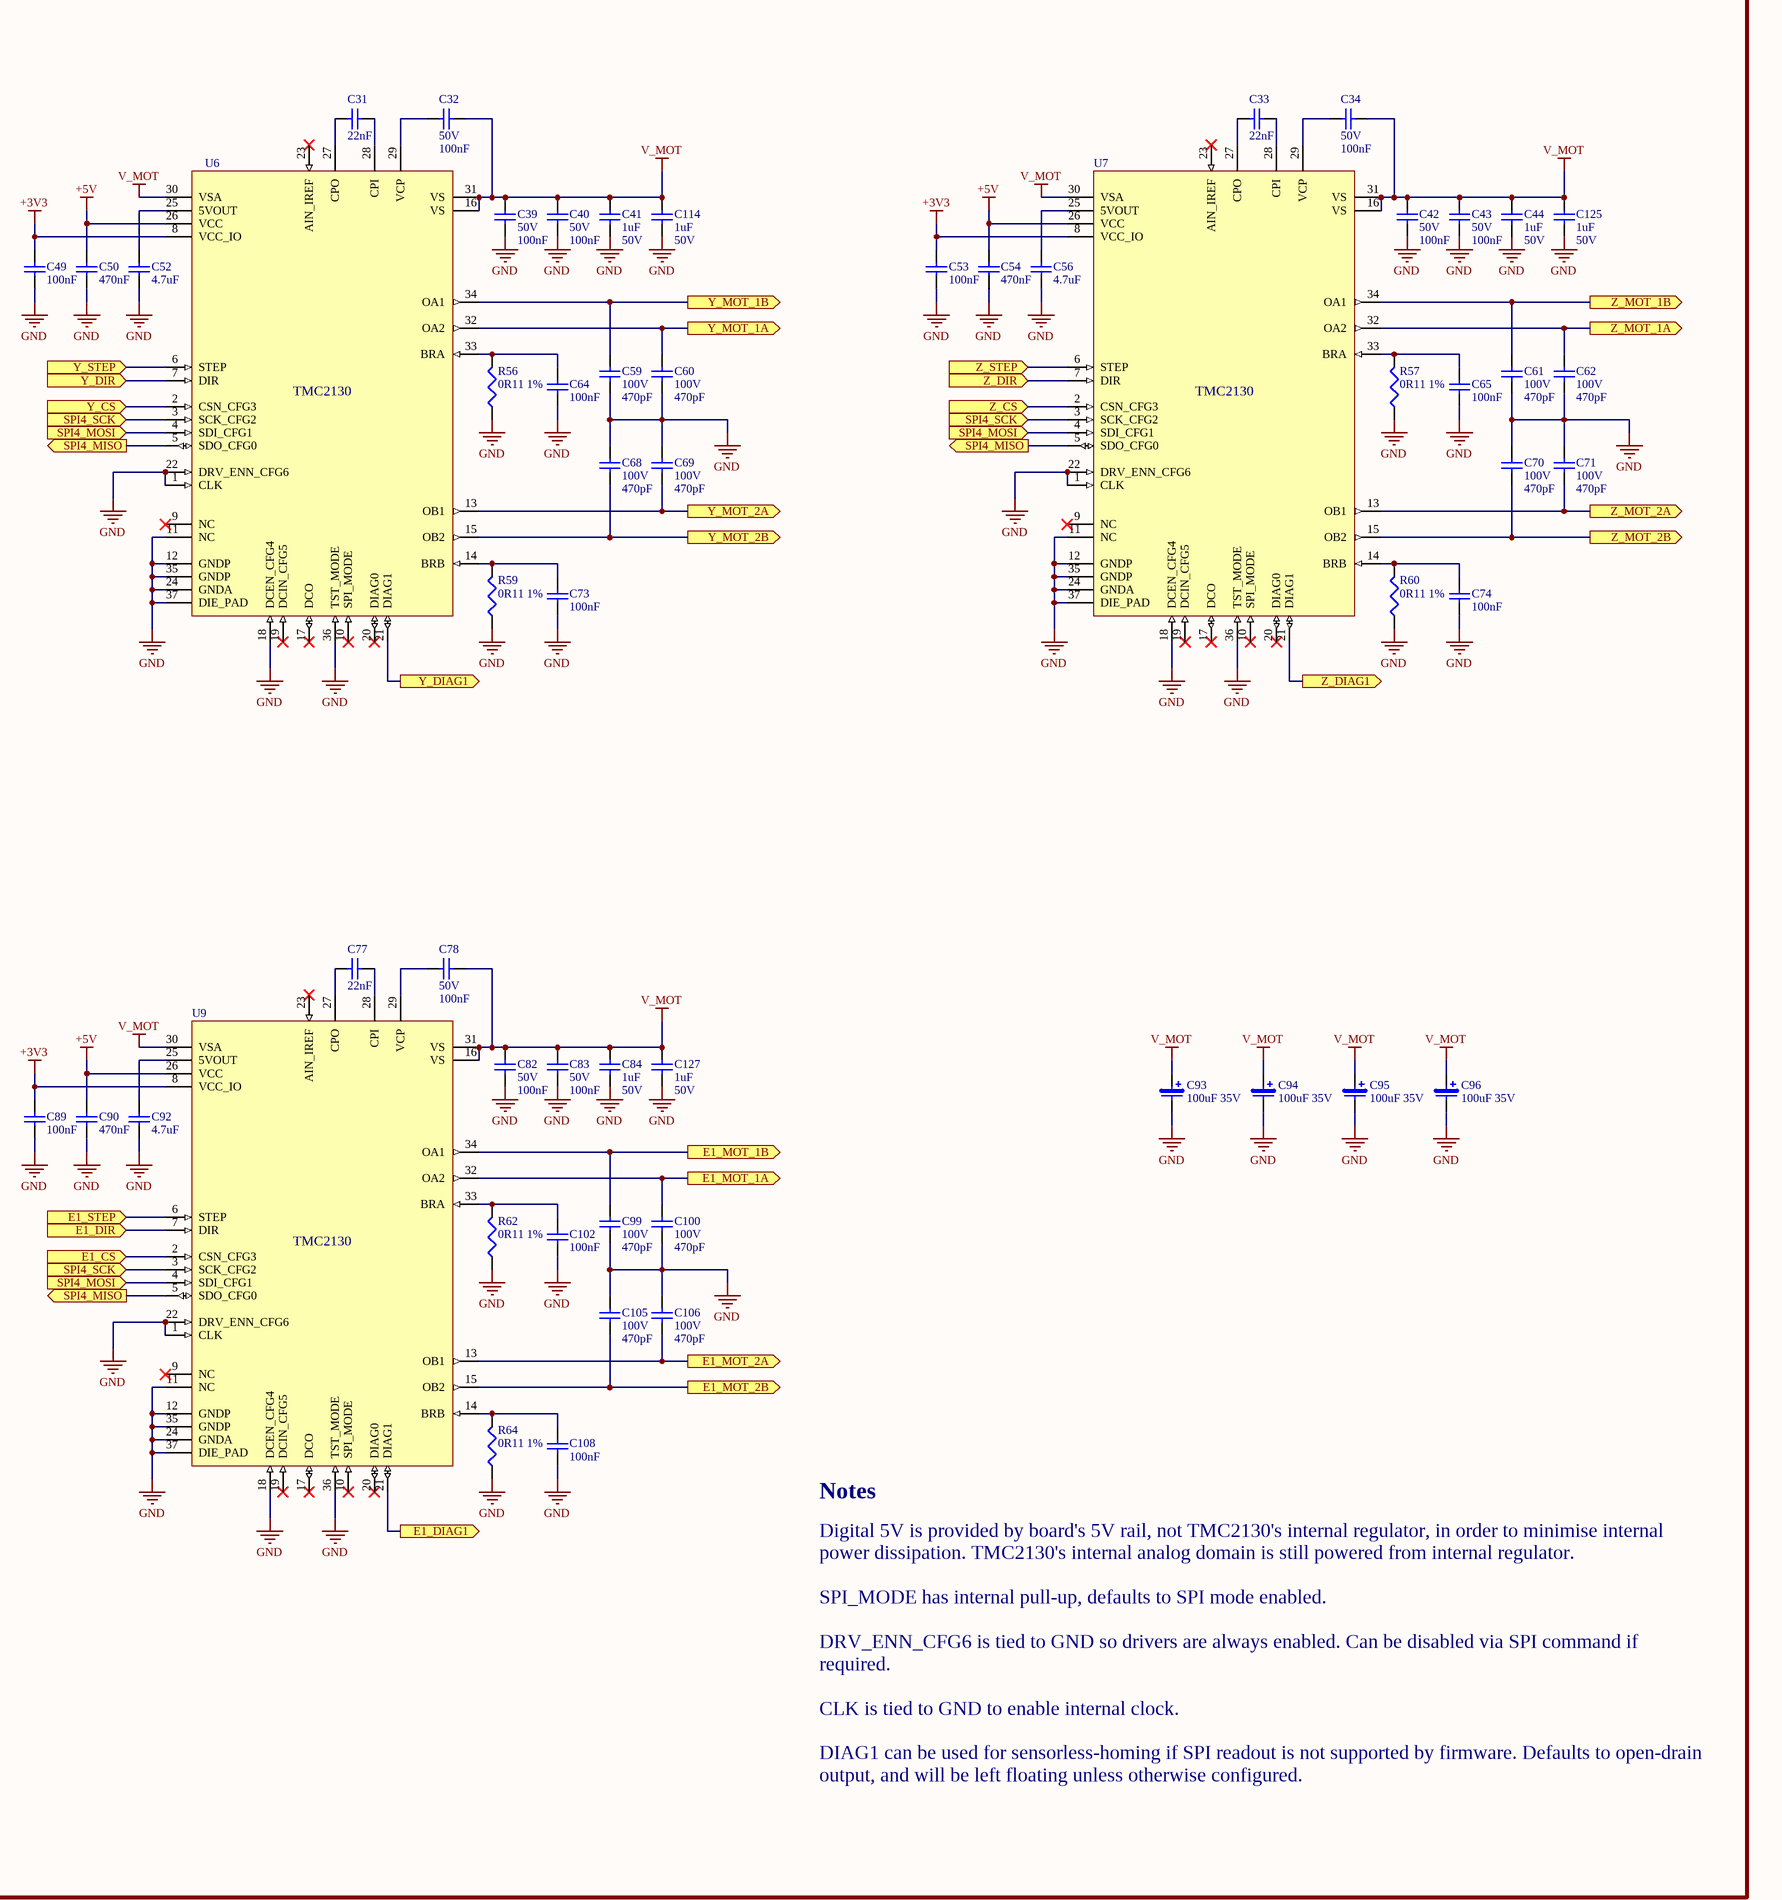
[diagram p4: PicoPrint-Motors.SchDoc, right]

### Parts
C29  value 22nF  [CAP 1005-0402]  (hidden comment: CapC-0402-22nF-50V)
C30  value 100nF  Voltage: 50V  [CAP 1005-0402]  (hidden comment: CapC-0402-100nF-50V)
C31  value 22nF  [CAP 1005-0402]  (hidden comment: CapC-0402-22nF-50V)
C32  value 100nF  Voltage: 50V  [CAP 1005-0402]  (hidden comment: CapC-0402-100nF-50V)
C33  value 22nF  [CAP 1005-0402]  (hidden comment: CapC-0402-22nF-50V)
C34  value 100nF  Voltage: 50V  [CAP 1005-0402]  (hidden comment: CapC-0402-100nF-50V)
C35  value 100nF  Voltage: 50V  [CAP 1005-0402]  (hidden comment: CapC-0402-100nF-50V)
C36  value 100nF  Voltage: 50V  [CAP 1005-0402]  (hidden comment: CapC-0402-100nF-50V)
C37  value 1uF  Voltage: 50V  [Cap 1608-0603]  (hidden comment: CapC-0603-1uF 50V)
C38  value 1uF  Voltage: 50V  [Cap 1608-0603]  (hidden comment: CapC-0603-1uF 50V)
C39  value 100nF  Voltage: 50V  [CAP 1005-0402]  (hidden comment: CapC-0402-100nF-50V)
C40  value 100nF  Voltage: 50V  [CAP 1005-0402]  (hidden comment: CapC-0402-100nF-50V)
C41  value 1uF  Voltage: 50V  [Cap 1608-0603]  (hidden comment: CapC-0603-1uF 50V)
C42  value 100nF  Voltage: 50V  [CAP 1005-0402]  (hidden comment: CapC-0402-100nF-50V)
C43  value 100nF  Voltage: 50V  [CAP 1005-0402]  (hidden comment: CapC-0402-100nF-50V)
C44  value 1uF  Voltage: 50V  [Cap 1608-0603]  (hidden comment: CapC-0603-1uF 50V)
C45  value 100nF  [CAP 1005-0402]  (hidden comment: CapC-0402-100nF)
C46  value 470nF  [CAP 1005-0402]  (hidden comment: CapC-0402-470nF)
C48  value 4.7uF  [CAP 1005-0402]  (hidden comment: CapC-0402-4.7uF-10V)
C49  value 100nF  [CAP 1005-0402]  (hidden comment: CapC-0402-100nF)
C50  value 470nF  [CAP 1005-0402]  (hidden comment: CapC-0402-470nF)
C52  value 4.7uF  [CAP 1005-0402]  (hidden comment: CapC-0402-4.7uF-10V)
C53  value 100nF  [CAP 1005-0402]  (hidden comment: CapC-0402-100nF)
C54  value 470nF  [CAP 1005-0402]  (hidden comment: CapC-0402-470nF)
C56  value 4.7uF  [CAP 1005-0402]  (hidden comment: CapC-0402-4.7uF-10V)
C57  value 470pF  Voltage: 100V  [CAP 1005-0402]  (hidden comment: CapC-0402-470pF-100V)
C58  value 470pF  Voltage: 100V  [CAP 1005-0402]  (hidden comment: CapC-0402-470pF-100V)
C59  value 470pF  Voltage: 100V  [CAP 1005-0402]  (hidden comment: CapC-0402-470pF-100V)
C60  value 470pF  Voltage: 100V  [CAP 1005-0402]  (hidden comment: CapC-0402-470pF-100V)
C61  value 470pF  Voltage: 100V  [CAP 1005-0402]  (hidden comment: CapC-0402-470pF-100V)
C62  value 470pF  Voltage: 100V  [CAP 1005-0402]  (hidden comment: CapC-0402-470pF-100V)
C63  value 100nF  [CAP 1005-0402]  (hidden comment: CapC-0402-100nF)
C64  value 100nF  [CAP 1005-0402]  (hidden comment: CapC-0402-100nF)
C65  value 100nF  [CAP 1005-0402]  (hidden comment: CapC-0402-100nF)
C66  value 470pF  Voltage: 100V  [CAP 1005-0402]  (hidden comment: CapC-0402-470pF-100V)
C67  value 470pF  Voltage: 100V  [CAP 1005-0402]  (hidden comment: CapC-0402-470pF-100V)
C68  value 470pF  Voltage: 100V  [CAP 1005-0402]  (hidden comment: CapC-0402-470pF-100V)
C69  value 470pF  Voltage: 100V  [CAP 1005-0402]  (hidden comment: CapC-0402-470pF-100V)
C70  value 470pF  Voltage: 100V  [CAP 1005-0402]  (hidden comment: CapC-0402-470pF-100V)
C71  value 470pF  Voltage: 100V  [CAP 1005-0402]  (hidden comment: CapC-0402-470pF-100V)
C72  value 100nF  [CAP 1005-0402]  (hidden comment: CapC-0402-100nF)
C73  value 100nF  [CAP 1005-0402]  (hidden comment: CapC-0402-100nF)
C74  value 100nF  [CAP 1005-0402]  (hidden comment: CapC-0402-100nF)
C75  value 22nF  [CAP 1005-0402]  (hidden comment: CapC-0402-22nF-50V)
C76  value 100nF  Voltage: 50V  [CAP 1005-0402]  (hidden comment: CapC-0402-100nF-50V)
C77  value 22nF  [CAP 1005-0402]  (hidden comment: CapC-0402-22nF-50V)
C78  value 100nF  Voltage: 50V  [CAP 1005-0402]  (hidden comment: CapC-0402-100nF-50V)
C79  value 100nF  Voltage: 50V  [CAP 1005-0402]  (hidden comment: CapC-0402-100nF-50V)
C80  value 100nF  Voltage: 50V  [CAP 1005-0402]  (hidden comment: CapC-0402-100nF-50V)
C81  value 1uF  Voltage: 50V  [Cap 1608-0603]  (hidden comment: CapC-0603-1uF 50V)
C82  value 100nF  Voltage: 50V  [CAP 1005-0402]  (hidden comment: CapC-0402-100nF-50V)
C83  value 100nF  Voltage: 50V  [CAP 1005-0402]  (hidden comment: CapC-0402-100nF-50V)
C84  value 1uF  Voltage: 50V  [Cap 1608-0603]  (hidden comment: CapC-0603-1uF 50V)
C85  value 100nF  [CAP 1005-0402]  (hidden comment: CapC-0402-100nF)
C86  value 470nF  [CAP 1005-0402]  (hidden comment: CapC-0402-470nF)
C88  value 4.7uF  [CAP 1005-0402]  (hidden comment: CapC-0402-4.7uF-10V)
C89  value 100nF  [CAP 1005-0402]  (hidden comment: CapC-0402-100nF)
C90  value 470nF  [CAP 1005-0402]  (hidden comment: CapC-0402-470nF)
C92  value 4.7uF  [CAP 1005-0402]  (hidden comment: CapC-0402-4.7uF-10V)
C93  value 100uF 35V  [CAP EL PANASONIC]  (hidden comment: CapE-6.3-100uF-35V)
C94  value 100uF 35V  [CAP EL PANASONIC]  (hidden comment: CapE-6.3-100uF-35V)
C95  value 100uF 35V  [CAP EL PANASONIC]  (hidden comment: CapE-6.3-100uF-35V)
C96  value 100uF 35V  [CAP EL PANASONIC]  (hidden comment: CapE-6.3-100uF-35V)
C97  value 470pF  Voltage: 100V  [CAP 1005-0402]  (hidden comment: CapC-0402-470pF-100V)
C98  value 470pF  Voltage: 100V  [CAP 1005-0402]  (hidden comment: CapC-0402-470pF-100V)
C99  value 470pF  Voltage: 100V  [CAP 1005-0402]  (hidden comment: CapC-0402-470pF-100V)
C100  value 470pF  Voltage: 100V  [CAP 1005-0402]  (hidden comment: CapC-0402-470pF-100V)
C101  value 100nF  [CAP 1005-0402]  (hidden comment: CapC-0402-100nF)
C102  value 100nF  [CAP 1005-0402]  (hidden comment: CapC-0402-100nF)
C103  value 470pF  Voltage: 100V  [CAP 1005-0402]  (hidden comment: CapC-0402-470pF-100V)
C104  value 470pF  Voltage: 100V  [CAP 1005-0402]  (hidden comment: CapC-0402-470pF-100V)
C105  value 470pF  Voltage: 100V  [CAP 1005-0402]  (hidden comment: CapC-0402-470pF-100V)
C106  value 470pF  Voltage: 100V  [CAP 1005-0402]  (hidden comment: CapC-0402-470pF-100V)
C107  value 100nF  [CAP 1005-0402]  (hidden comment: CapC-0402-100nF)
C108  value 100nF  [CAP 1005-0402]  (hidden comment: CapC-0402-100nF)
C114  value 1uF  Voltage: 50V  [Cap 1608-0603]  (hidden comment: CapC-0603-1uF 50V)
C125  value 1uF  Voltage: 50V  [Cap 1608-0603]  (hidden comment: CapC-0603-1uF 50V)
C126  value 1uF  Voltage: 50V  [Cap 1608-0603]  (hidden comment: CapC-0603-1uF 50V)
C127  value 1uF  Voltage: 50V  [Cap 1608-0603]  (hidden comment: CapC-0603-1uF 50V)
R55  value 0R11 1%  [Res 2012-0805]  (hidden comment: Res-0805-0R11-0.333W)
R56  value 0R11 1%  [Res 2012-0805]  (hidden comment: Res-0805-0R11-0.333W)
R57  value 0R11 1%  [Res 2012-0805]  (hidden comment: Res-0805-0R11-0.333W)
R58  value 0R11 1%  [Res 2012-0805]  (hidden comment: Res-0805-0R11-0.333W)
R59  value 0R11 1%  [Res 2012-0805]  (hidden comment: Res-0805-0R11-0.333W)
R60  value 0R11 1%  [Res 2012-0805]  (hidden comment: Res-0805-0R11-0.333W)
R61  value 0R11 1%  [Res 2012-0805]  (hidden comment: Res-0805-0R11-0.333W)
R62  value 0R11 1%  [Res 2012-0805]  (hidden comment: Res-0805-0R11-0.333W)
R63  value 0R11 1%  [Res 2012-0805]  (hidden comment: Res-0805-0R11-0.333W)
R64  value 0R11 1%  [Res 2012-0805]  (hidden comment: Res-0805-0R11-0.333W)
U5  TMC2130-LA  [QFN50P500X600X90_HS-37N]  (value not drawn)
U6  TMC2130-LA  [QFN50P500X600X90_HS-37N]  (value not drawn)
U7  TMC2130-LA  [QFN50P500X600X90_HS-37N]  (value not drawn)
U8  TMC2130-LA  [QFN50P500X600X90_HS-37N]  (value not drawn)
U9  TMC2130-LA  [QFN50P500X600X90_HS-37N]  (value not drawn)

### Ports
E0_CS (in), E0_DIAG1 (out), E0_DIR (in), E0_MOT_1A (out), E0_MOT_1B (out), E0_MOT_2A (out), E0_MOT_2B (out), E0_STEP (in), E1_CS (in), E1_DIAG1 (out), E1_DIR (in), E1_MOT_1A (out), E1_MOT_1B (out), E1_MOT_2A (out), E1_MOT_2B (out), E1_STEP (in), SPI4_MISO (out), SPI4_MOSI (in), SPI4_SCK (in), X_CS (in), X_DIAG1 (out), X_DIR (in), X_MOT_1A (out), X_MOT_1B (out), X_MOT_2A (out), X_MOT_2B (out), X_STEP (in), Y_CS (in), Y_DIAG1 (out), Y_DIR (in), Y_MOT_1A (out), Y_MOT_1B (out), Y_MOT_2A (out), Y_MOT_2B (out), Y_STEP (in), Z_CS (in), Z_DIAG1 (out), Z_DIR (in), Z_MOT_1A (out), Z_MOT_1B (out), Z_MOT_2A (out), Z_MOT_2B (out), Z_STEP (in)

### Nets
+3V3: C45.2 C49.2 C53.2 C85.2 C89.2 U5.8(VCC_IO) U6.8(VCC_IO) U7.8(VCC_IO) U8.8(VCC_IO) U9.8(VCC_IO)
+5V: C46.2 C50.2 C54.2 C86.2 C90.2 U5.26(VCC) U6.26(VCC) U7.26(VCC) U8.26(VCC) U9.26(VCC)
GND: C35.2 C36.2 C37.1 C38.1 C39.2 C40.2 C41.1 C42.2 C43.2 C44.1 C45.1 C46.1 C48.1 C49.1 C50.1 C52.1 C53.1 C54.1 C56.1 C57.1 C58.1 C59.1 C60.1 C61.1 C62.1 C63.2 C64.2 C65.2 C66.2 C67.2 C68.2 C69.2 C70.2 C71.2 C72.2 C73.2 C74.2 C79.2 C80.2 C81.1 C82.2 C83.2 C84.1 C85.1 C86.1 C88.1 C89.1 C90.1 C92.1 C93.2 C94.2 C95.2 C96.2 C97.1 C98.1 C99.1 C100.1 C101.2 C102.2 C103.2 C104.2 C105.2 C106.2 C107.2 C108.2 C114.1 C125.1 C126.1 C127.1 R55.1 R56.1 R57.1 R58.1 R59.1 R60.1 R61.1 R62.1 R63.1 R64.1 U5.1(CLK) U5.11(NC) U5.12(GNDP) U5.18(DCEN_CFG4) U5.22(DRV_ENN_CFG6) U5.24(GNDA) U5.35(GNDP) U5.36(TST_MODE) U5.37(DIE_PAD) U6.1(CLK) U6.11(NC) U6.12(GNDP) U6.18(DCEN_CFG4) U6.22(DRV_ENN_CFG6) U6.24(GNDA) U6.35(GNDP) U6.36(TST_MODE) U6.37(DIE_PAD) U7.1(CLK) U7.11(NC) U7.12(GNDP) U7.18(DCEN_CFG4) U7.22(DRV_ENN_CFG6) U7.24(GNDA) U7.35(GNDP) U7.36(TST_MODE) U7.37(DIE_PAD) U8.1(CLK) U8.11(NC) U8.12(GNDP) U8.18(DCEN_CFG4) U8.22(DRV_ENN_CFG6) U8.24(GNDA) U8.35(GNDP) U8.36(TST_MODE) U8.37(DIE_PAD) U9.1(CLK) U9.11(NC) U9.12(GNDP) U9.18(DCEN_CFG4) U9.22(DRV_ENN_CFG6) U9.24(GNDA) U9.35(GNDP) U9.36(TST_MODE) U9.37(DIE_PAD)
V_MOT: C30.1 C32.1 C34.1 C35.1 C36.1 C37.2 C38.2 C39.1 C40.1 C41.2 C42.1 C43.1 C44.2 C76.1 C78.1 C79.1 C80.1 C81.2 C82.1 C83.1 C84.2 C93.1 C94.1 C95.1 C96.1 C114.2 C125.2 C126.2 C127.2 U5.16(VS) U5.30(VSA) U5.31(VS) U6.16(VS) U6.30(VSA) U6.31(VS) U7.16(VS) U7.30(VSA) U7.31(VS) U8.16(VS) U8.30(VSA) U8.31(VS) U9.16(VS) U9.30(VSA) U9.31(VS)
E0_CS: U8.2(CSN_CFG3) ; port E0_CS
E0_DIAG1: U8.21(DIAG1) ; port E0_DIAG1
E0_DIR: U8.7(DIR) ; port E0_DIR
E0_MOT_1A: C98.2 U8.32(OA2) ; port E0_MOT_1A
E0_MOT_1B: C97.2 U8.34(OA1) ; port E0_MOT_1B
E0_MOT_2A: C104.1 U8.13(OB1) ; port E0_MOT_2A
E0_MOT_2B: C103.1 U8.15(OB2) ; port E0_MOT_2B
E0_STEP: U8.6(STEP) ; port E0_STEP
E1_CS: U9.2(CSN_CFG3) ; port E1_CS
E1_DIAG1: U9.21(DIAG1) ; port E1_DIAG1
E1_DIR: U9.7(DIR) ; port E1_DIR
E1_MOT_1A: C100.2 U9.32(OA2) ; port E1_MOT_1A
E1_MOT_1B: C99.2 U9.34(OA1) ; port E1_MOT_1B
E1_MOT_2A: C106.1 U9.13(OB1) ; port E1_MOT_2A
E1_MOT_2B: C105.1 U9.15(OB2) ; port E1_MOT_2B
E1_STEP: U9.6(STEP) ; port E1_STEP
SPI4_MISO: U5.5(SDO_CFG0) U6.5(SDO_CFG0) U7.5(SDO_CFG0) U8.5(SDO_CFG0) U9.5(SDO_CFG0) ; port SPI4_MISO
SPI4_MOSI: U5.4(SDI_CFG1) U6.4(SDI_CFG1) U7.4(SDI_CFG1) U8.4(SDI_CFG1) U9.4(SDI_CFG1) ; port SPI4_MOSI
SPI4_SCK: U5.3(SCK_CFG2) U6.3(SCK_CFG2) U7.3(SCK_CFG2) U8.3(SCK_CFG2) U9.3(SCK_CFG2) ; port SPI4_SCK
X_CS: U5.2(CSN_CFG3) ; port X_CS
X_DIAG1: U5.21(DIAG1) ; port X_DIAG1
X_DIR: U5.7(DIR) ; port X_DIR
X_MOT_1A: C58.2 U5.32(OA2) ; port X_MOT_1A
X_MOT_1B: C57.2 U5.34(OA1) ; port X_MOT_1B
X_MOT_2A: C67.1 U5.13(OB1) ; port X_MOT_2A
X_MOT_2B: C66.1 U5.15(OB2) ; port X_MOT_2B
X_STEP: U5.6(STEP) ; port X_STEP
Y_CS: U6.2(CSN_CFG3) ; port Y_CS
Y_DIAG1: U6.21(DIAG1) ; port Y_DIAG1
Y_DIR: U6.7(DIR) ; port Y_DIR
Y_MOT_1A: C60.2 U6.32(OA2) ; port Y_MOT_1A
Y_MOT_1B: C59.2 U6.34(OA1) ; port Y_MOT_1B
Y_MOT_2A: C69.1 U6.13(OB1) ; port Y_MOT_2A
Y_MOT_2B: C68.1 U6.15(OB2) ; port Y_MOT_2B
Y_STEP: U6.6(STEP) ; port Y_STEP
Z_CS: U7.2(CSN_CFG3) ; port Z_CS
Z_DIAG1: U7.21(DIAG1) ; port Z_DIAG1
Z_DIR: U7.7(DIR) ; port Z_DIR
Z_MOT_1A: C62.2 U7.32(OA2) ; port Z_MOT_1A
Z_MOT_1B: C61.2 U7.34(OA1) ; port Z_MOT_1B
Z_MOT_2A: C71.1 U7.13(OB1) ; port Z_MOT_2A
Z_MOT_2B: C70.1 U7.15(OB2) ; port Z_MOT_2B
Z_STEP: U7.6(STEP) ; port Z_STEP
NetC29_1: C29.1 U5.27(CPO)
NetC29_2: C29.2 U5.28(CPI)
NetC30_2: C30.2 U5.29(VCP)
NetC31_1: C31.1 U6.27(CPO)
NetC31_2: C31.2 U6.28(CPI)
NetC32_2: C32.2 U6.29(VCP)
NetC33_1: C33.1 U7.27(CPO)
NetC33_2: C33.2 U7.28(CPI)
NetC34_2: C34.2 U7.29(VCP)
NetC48_2: C48.2 U5.25(5VOUT)
NetC52_2: C52.2 U6.25(5VOUT)
NetC56_2: C56.2 U7.25(5VOUT)
NetC63_1: C63.1 R55.2 U5.33(BRA)
NetC64_1: C64.1 R56.2 U6.33(BRA)
NetC65_1: C65.1 R57.2 U7.33(BRA)
NetC72_1: C72.1 R58.2 U5.14(BRB)
NetC73_1: C73.1 R59.2 U6.14(BRB)
NetC74_1: C74.1 R60.2 U7.14(BRB)
NetC75_1: C75.1 U8.27(CPO)
NetC75_2: C75.2 U8.28(CPI)
NetC76_2: C76.2 U8.29(VCP)
NetC77_1: C77.1 U9.27(CPO)
NetC77_2: C77.2 U9.28(CPI)
NetC78_2: C78.2 U9.29(VCP)
NetC88_2: C88.2 U8.25(5VOUT)
NetC92_2: C92.2 U9.25(5VOUT)
NetC101_1: C101.1 R61.2 U8.33(BRA)
NetC102_1: C102.1 R62.2 U9.33(BRA)
NetC107_1: C107.1 R63.2 U8.14(BRB)
NetC108_1: C108.1 R64.2 U9.14(BRB)

Not connected (* = marked no-connect by the designer): U5 9(NC)* 10(SPI_MODE)* 17(DCO)* 19(DCIN_CFG5)* 20(DIAG0)* 23(AIN_IREF)*; U6 9(NC)* 10(SPI_MODE)* 17(DCO)* 19(DCIN_CFG5)* 20(DIAG0)* 23(AIN_IREF)*; U7 9(NC)* 10(SPI_MODE)* 17(DCO)* 19(DCIN_CFG5)* 20(DIAG0)* 23(AIN_IREF)*; U8 9(NC)* 10(SPI_MODE)* 17(DCO)* 19(DCIN_CFG5)* 20(DIAG0)* 23(AIN_IREF)*; U9 9(NC)* 10(SPI_MODE)* 17(DCO)* 19(DCIN_CFG5)* 20(DIAG0)* 23(AIN_IREF)*

### Notes on the sheet
- Stepper Drivers
- Notes
- Date:
- Revision:
- Digital 5V is provided by board's 5V rail, not TMC2130's internal regulator, in order to minimise internal power dissipation. TMC2130's internal analog domain is still powered from internal regulator.
  SPI_MODE has internal pull-up, defaults to SPI mode enabled.
  DRV_ENN_CFG6 is tied to GND so drivers are always enabled. Can be disabled via SPI command if required.
  CLK is tied to GND to enable internal clock.
  DIAG1 can be used for sensorless-homing if SPI readout is not supported by firmware. Defaults to open-drain output, and will be left floating unless otherwise configured.
- Aus3D
- Drawn:
- Page:
- of
- (in symbol TMC2130_LA) TMC2130

### Library data of the parts
C29 C31 C33 C75 C77 = CapC-0402-22nF-50V: Capacitor (SMD Ceramic); Voltage: 50V; Note: Approved sub OK; Published: 8-Jun-2000; Revision: July-2002: Re-released for DXP Platform.; Publisher: Altium Limited; Supplier 1: Digi-Key; Supplier Part Number 1: 490-3884-1-ND
C30 C32 C34-C36 C39 C40 C42 C43 C76 C78-C80 C82 C83 = CapC-0402-100nF-50V: Capacitor (SMD Ceramic); Note: Approved sub OK; Published: 8-Jun-2000; Revision: July-2002: Re-released for DXP Platform.; Publisher: Altium Limited; Supplier 1: Digi-Key; Supplier Part Number 1: 490-10700-1-ND
C37 C38 C41 C44 C81 C84 C114 C125-C127 = CapC-0603-1uF 50V: as C110 on sheet PicoPrint-Power; Published: 8-Jun-2000; Revision: July-2002: Re-released for DXP Platform.; Publisher: Altium Limited; Supplier 1: Digi-Key; Supplier Part Number 1: 1276-1860-1-ND
C45 C49 C53 C63-C65 C72-C74 C85 C89 C101 C102 C107 C108 = CapC-0402-100nF: as C115 on sheet PicoPrint-Power; Published: 8-Jun-2000; Revision: July-2002: Re-released for DXP Platform.; Publisher: Altium Limited; Supplier 1: Digi-Key; Supplier Part Number 1: 311-1336-1-ND
C46 C50 C54 C86 C90 = CapC-0402-470nF: Capacitor (SMD Ceramic); Note: Approved sub OK; Published: 8-Jun-2000; Revision: July-2002: Re-released for DXP Platform.; Publisher: Altium Limited; Supplier 1: Digi-Key; Supplier Part Number 1: 1276-1173-1-ND
C48 C52 C56 C88 C92 = CapC-0402-4.7uF-10V: as C1 on sheet PicoPrint-Connectors; Published: 8-Jun-2000; Revision: July-2002: Re-released for DXP Platform.; Publisher: Altium Limited; Supplier 1: Digi-Key; Supplier Part Number 1: 1276-1482-1-ND
C57-C62 C66-C71 C97-C100 C103-C106 = CapC-0402-470pF-100V: Capacitor (SMD Ceramic); Note: Approved sub OK; Published: 8-Jun-2000; Revision: July-2002: Re-released for DXP Platform.; Publisher: Altium Limited; Supplier 1: Digi-Key; Supplier Part Number 1: 490-6369-1-ND
C93-C96 = CapE-6.3-100uF-35V: as C112 on sheet PicoPrint-Power; Published: 8-Jun-2000; Revision: July-2002: Re-released for DXP Platform.; Publisher: Altium Limited; Supplier 1: Digi-Key; Supplier Part Number 1: PCE5016CT-ND
R55-R64 = Res-0805-0R11: Resistor; Note: Approved sub OK; Published: 8-Jun-2000; Revision: July-2002: Re-released for DXP Platform.; Publisher: Altium Limited; Supplier 1: Digi-Key; Supplier Part Number 1: RL12S.11FCT-ND
U5-U9 = TMC2130_LA: Stepper Driver IC; Supplier 1: Digi-Key; Supplier Part Number 1: 1460-1130-1-ND